# EAGLE design InkTime (EAGLE 9.7.0)
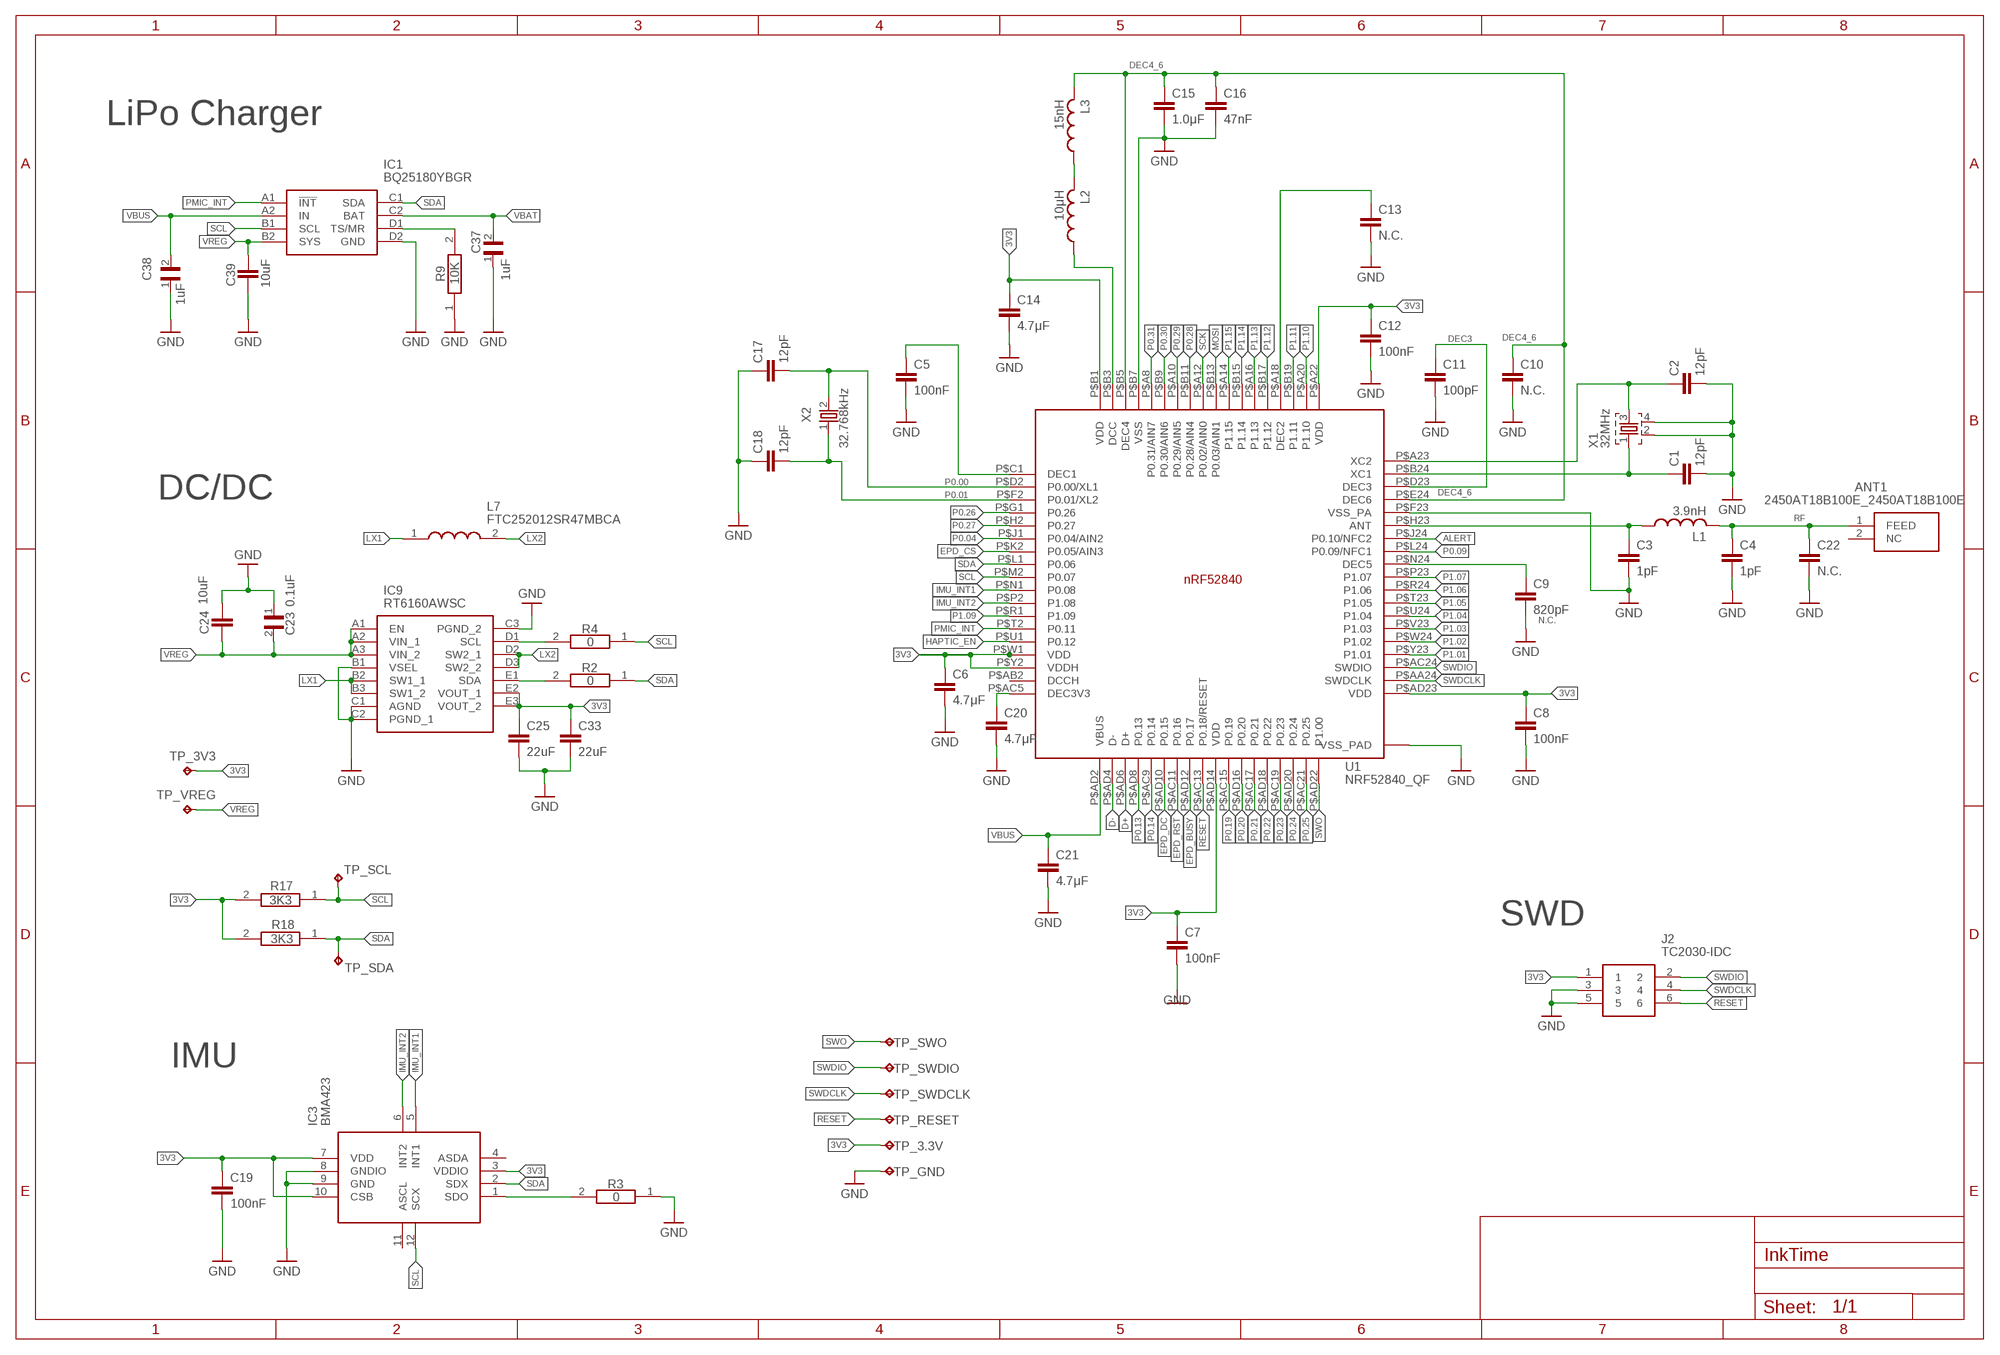
[diagram p0: schematic, sheet 1, part 1 of 2]
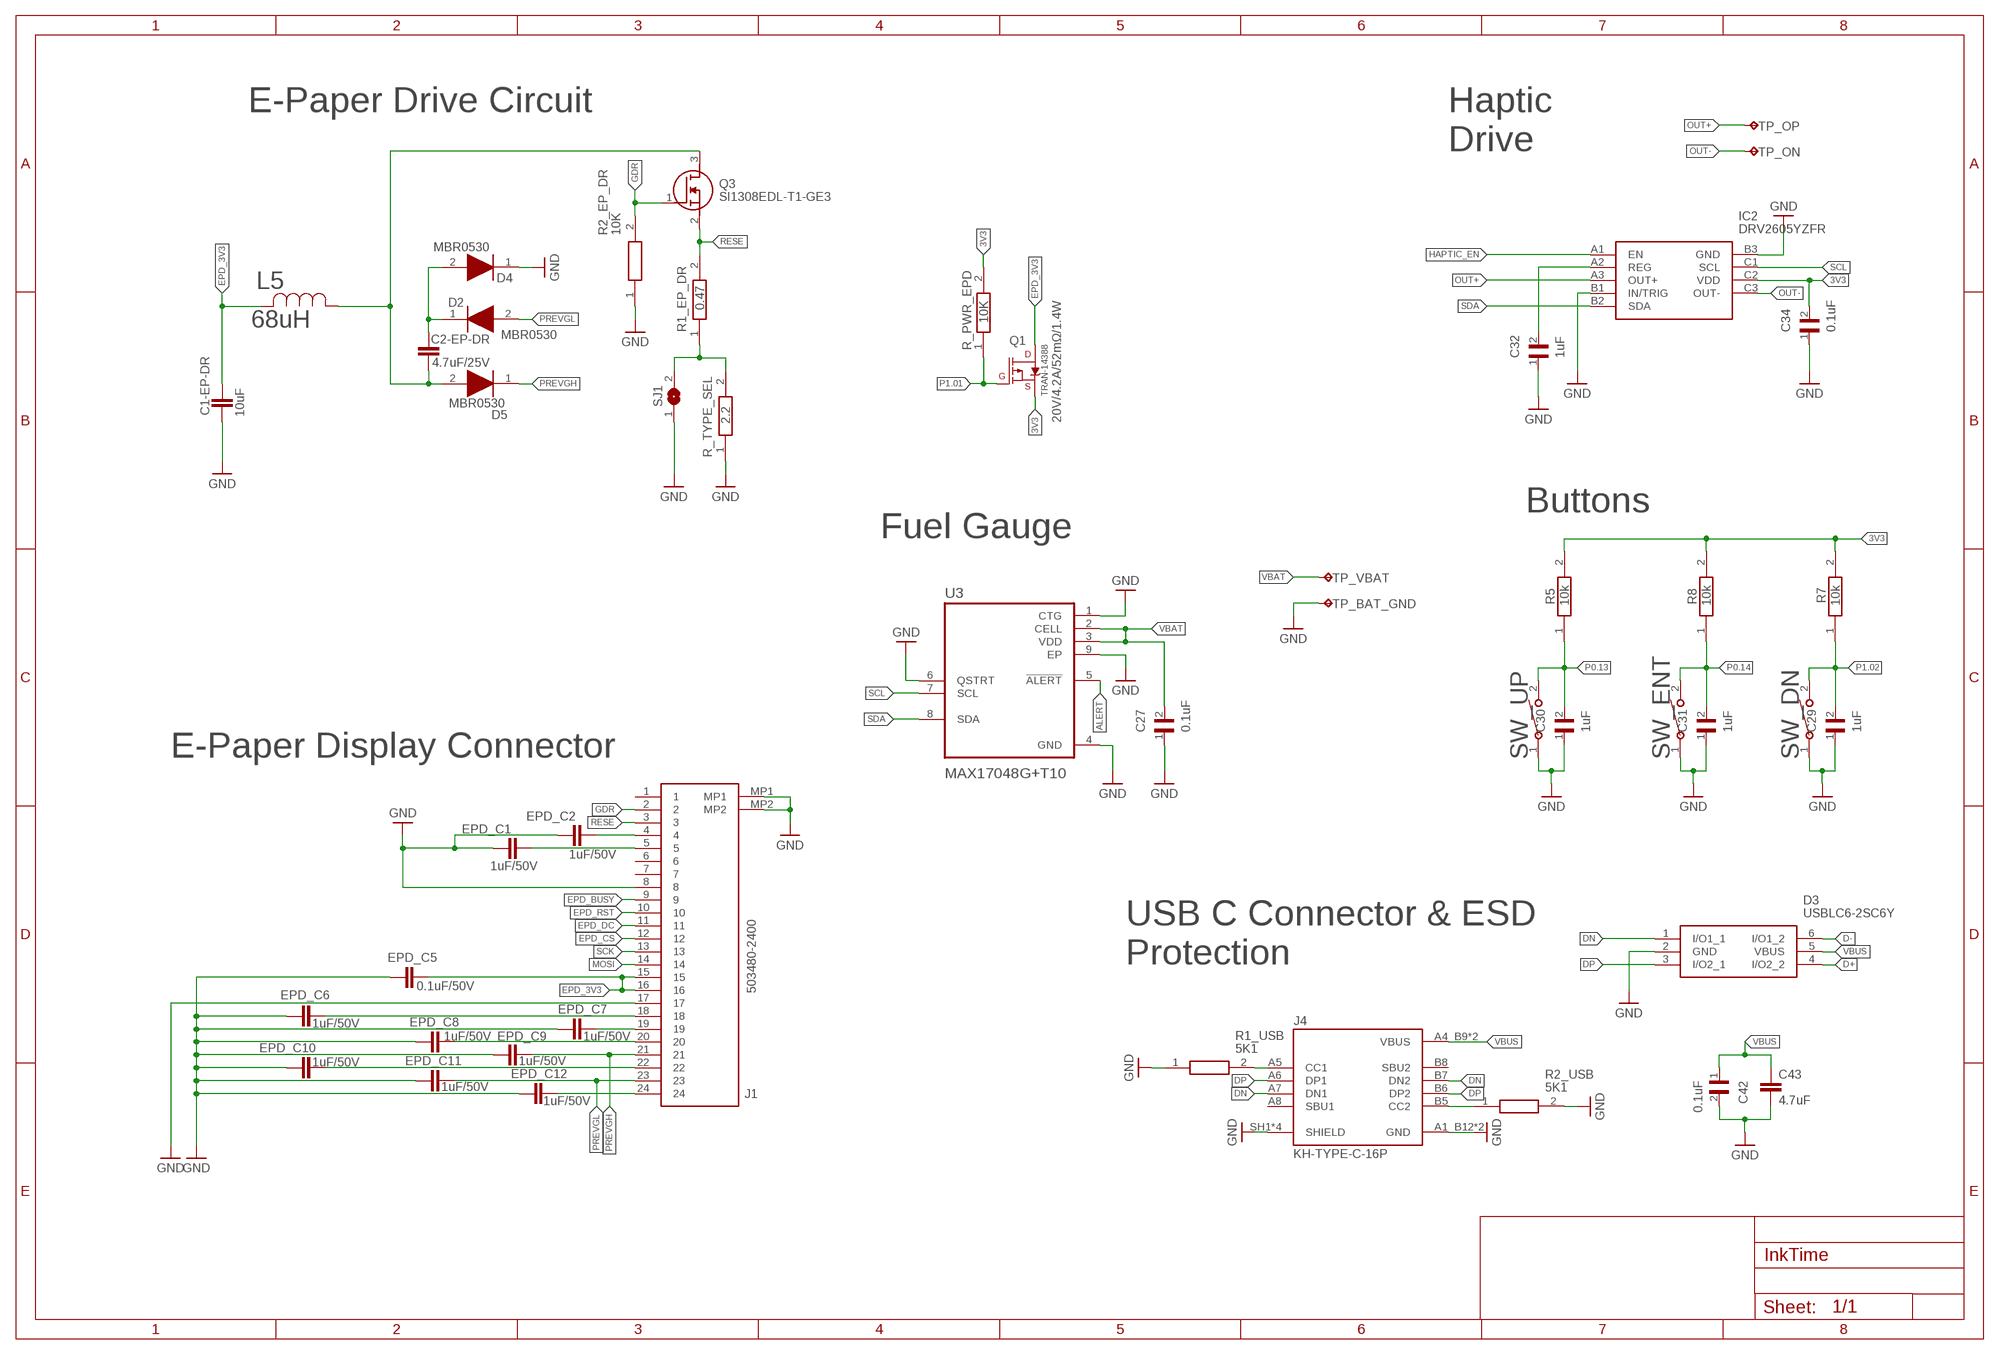
[diagram p1: schematic, sheet 1, part 2 of 2]

## Parts
ANT1  2450AT18B100E_2450AT18B100E  [2450AT18B100E_ANTC3216X140N]
C1  12pF  NORDIC_NRF_3_CAPACITOR_0201_L  [NORDIC_NRF_3_RESC0201_L]
C1-EP-DR  10uF  NORDIC_NRF_3_CAPACITOR_0402_L  [NORDIC_NRF_3_RESC0402_L]
C2  12pF  NORDIC_NRF_3_CAPACITOR_0201_L  [NORDIC_NRF_3_RESC0201_L]
C2-EP-DR  4.7uF/25V  NORDIC_NRF_3_CAPACITOR_0402_L  [NORDIC_NRF_3_RESC0402_L]
C3  1pF  NORDIC_NRF_3_CAPACITOR_0201_L  [NORDIC_NRF_3_RESC0201_L]
C4  1pF  NORDIC_NRF_3_CAPACITOR_0201_L  [NORDIC_NRF_3_RESC0201_L]
C5  100nF  NORDIC_NRF_3_CAPACITOR_0201_L  [NORDIC_NRF_3_RESC0201_L]
C6  4.7μF  NORDIC_NRF_3_CAPACITOR_0402_L  [NORDIC_NRF_3_RESC0402_L]
C7  100nF  NORDIC_NRF_3_CAPACITOR_0201_L  [NORDIC_NRF_3_RESC0201_L]
C8  100nF  NORDIC_NRF_3_CAPACITOR_0201_L  [NORDIC_NRF_3_RESC0201_L]
C9  820pF  NORDIC_NRF_3_CAPACITOR_0201_L  [NORDIC_NRF_3_RESC0201_L]
C10  N.C.  NORDIC_NRF_3_CAPACITOR_0201_L  [NORDIC_NRF_3_RESC0201_L]
C11  100pF  NORDIC_NRF_3_CAPACITOR_0201_L  [NORDIC_NRF_3_RESC0201_L]
C12  100nF  NORDIC_NRF_3_CAPACITOR_0201_L  [NORDIC_NRF_3_RESC0201_L]
C13  N.C.  NORDIC_NRF_3_CAPACITOR_0201_L  [NORDIC_NRF_3_RESC0201_L]
C14  4.7μF  NORDIC_NRF_3_CAPACITOR_0402_L  [NORDIC_NRF_3_RESC0402_L]
C15  1.0μF  NORDIC_NRF_3_CAPACITOR_0402_L  [NORDIC_NRF_3_RESC0402_L]
C16  47nF  NORDIC_NRF_3_CAPACITOR_0201_L  [NORDIC_NRF_3_RESC0201_L]
C17  12pF  NORDIC_NRF_3_CAPACITOR_0201_L  [NORDIC_NRF_3_RESC0201_L]
C18  12pF  NORDIC_NRF_3_CAPACITOR_0201_L  [NORDIC_NRF_3_RESC0201_L]
C19  100nF  NORDIC_NRF_3_CAPACITOR_0201_L  [NORDIC_NRF_3_RESC0201_L]
C20  4.7μF  NORDIC_NRF_3_CAPACITOR_0402_L  [NORDIC_NRF_3_RESC0402_L]
C21  4.7μF  NORDIC_NRF_3_CAPACITOR_0402_L  [NORDIC_NRF_3_RESC0402_L]
C22  N.C.  NORDIC_NRF_3_CAPACITOR_0201_L  [NORDIC_NRF_3_RESC0201_L]
C23  0.1uF  GRM011R60J152KE01L_2_GRM011R60J152KE01L  [GRM011R60J152KE01L_2_CAPC0201X13N]
C24  10uF  NORDIC_NRF_3_CAPACITOR_0402_L  [NORDIC_NRF_3_RESC0402_L]
C25  22uF  NORDIC_NRF_3_CAPACITOR_0402_L  [NORDIC_NRF_3_RESC0402_L]
C27  0.1uF  GRM011R60J152KE01L_2_GRM011R60J152KE01L  [GRM011R60J152KE01L_2_CAPC0201X13N]
C29  1uF  GRM011R60J152KE01L_2_GRM011R60J152KE01L  [GRM011R60J152KE01L_2_CAPC0201X13N]
C30  1uF  GRM011R60J152KE01L_2_GRM011R60J152KE01L  [GRM011R60J152KE01L_2_CAPC0201X13N]
C31  1uF  GRM011R60J152KE01L_2_GRM011R60J152KE01L  [GRM011R60J152KE01L_2_CAPC0201X13N]
C32  1uF  GRM011R60J152KE01L_2_GRM011R60J152KE01L  [GRM011R60J152KE01L_2_CAPC0201X13N]
C33  22uF  NORDIC_NRF_3_CAPACITOR_0402_L  [NORDIC_NRF_3_RESC0402_L]
C34  0.1uF  GRM011R60J152KE01L_2_GRM011R60J152KE01L  [GRM011R60J152KE01L_2_CAPC0201X13N]
C37  1uF  GRM011R60J152KE01L_2_GRM011R60J152KE01L  [GRM011R60J152KE01L_2_CAPC0201X13N]
C38  1uF  GRM011R60J152KE01L_2_GRM011R60J152KE01L  [GRM011R60J152KE01L_2_CAPC0201X13N]
C39  10uF  NORDIC_NRF_3_CAPACITOR_0402_L  [NORDIC_NRF_3_RESC0402_L]
C42  0.1uF  GRM011R60J152KE01L_2_GRM011R60J152KE01L  [GRM011R60J152KE01L_2_CAPC0201X13N]
C43  4.7uF  NORDIC_NRF_3_CAPACITOR_0402_L  [NORDIC_NRF_3_RESC0402_L]
D2  MBR0530  ESP32_C6_LIBRARY_5_MBR0530  [ESP32_C6_LIBRARY_5_SOD3716X135N]
D3  USBLC6-2SC6Y  ESP32_C6_LIBRARY_3_USBLC6-2SC6Y  [ESP32_C6_LIBRARY_3_SOT95P280X145-6N]
D4  MBR0530  ESP32_C6_LIBRARY_5_MBR0530  [ESP32_C6_LIBRARY_5_SOD3716X135N]
D5  MBR0530  ESP32_C6_LIBRARY_5_MBR0530  [ESP32_C6_LIBRARY_5_SOD3716X135N]
EPD_C1  1uF/50V  NORDIC_NRF_3_CAPACITOR_0402_L  [NORDIC_NRF_3_RESC0402_L]
EPD_C2  1uF/50V  NORDIC_NRF_3_CAPACITOR_0402_L  [NORDIC_NRF_3_RESC0402_L]
EPD_C5  0.1uF/50V  NORDIC_NRF_3_CAPACITOR_0201_L  [NORDIC_NRF_3_RESC0201_L]
EPD_C6  1uF/50V  NORDIC_NRF_3_CAPACITOR_0402_L  [NORDIC_NRF_3_RESC0402_L]
EPD_C7  1uF/50V  NORDIC_NRF_3_CAPACITOR_0402_L  [NORDIC_NRF_3_RESC0402_L]
EPD_C8  1uF/50V  NORDIC_NRF_3_CAPACITOR_0402_L  [NORDIC_NRF_3_RESC0402_L]
EPD_C9  1uF/50V  NORDIC_NRF_3_CAPACITOR_0402_L  [NORDIC_NRF_3_RESC0402_L]
EPD_C10  1uF/50V  NORDIC_NRF_3_CAPACITOR_0402_L  [NORDIC_NRF_3_RESC0402_L]
EPD_C11  1uF/50V  NORDIC_NRF_3_CAPACITOR_0402_L  [NORDIC_NRF_3_RESC0402_L]
EPD_C12  1uF/50V  NORDIC_NRF_3_CAPACITOR_0402_L  [NORDIC_NRF_3_RESC0402_L]
IC1  BQ25180YBGR  BQ25180YBGR_BQ25180YBGR  [BQ25180YBGR_BGA8C40P2X4_100X155X50]
IC2  DRV2605YZFR  DRV2605YZFR_DRV2605YZFR  [DRV2605YZFR_BGA9C50P3X3_144X144X62]
IC3  BMA423  BMA423_BMA423  [BMA423_BMA423]
IC9  RT6160AWSC  RT6160AWSC_RT6160AWSC  [RT6160AWSC_BGA15C40P3X5_140X230X60]
J1  503480-2400  503480-2400_503480-2400  [503480-2400_5034802400]
J2  TC2030-IDC  TC2030-IDC_TC2030-IDC  [TC2030-IDC_TC2030IDC]
J4  KH-TYPE-C-16P  KH-TYPE-C-16P_KH-TYPE-C-16P  [KH-TYPE-C-16P_KINGHELM_KH-TYPE-C-16P]
L1  3.9nH  NORDIC_NRF_2_INDUCTOR_0402_L  [NORDIC_NRF_2_RESC0402_L]
L2  10μH  NORDIC_NRF_2_INDUCTOR_0402_L  [NORDIC_NRF_2_RESC0402_L]
L3  15nH  NORDIC_NRF_2_INDUCTOR_0402_L  [NORDIC_NRF_2_RESC0402_L]
L5  68uH  ESP32_C6_LIBRARY_2_744043680IND_4828-WE-TPC_WRE  [ESP32_C6_LIBRARY_2_IND_4828-WE-TPC_WRE]
L7  FTC252012SR47MBCA  MLP2016SR47MT0S1_FTC252012SR47MBCA  [MLP2016SR47MT0S1_INDC2016X100N]
Q1  20V/4.2A/52mΩ/1.4W  ESP32_C6_LIBRARY_4_ESP32_WROVER_SPARKFUN-DISCRETESEMI_MOSFET_PCH-DMG2305UX-7  [ESP32_C6_LIBRARY_4_ESP32_C6_LIBRARY_4_ESP32_C6_LIBRARY_4_ESP32_C6_LIBRARY_4_ESP32_WROVER_SPARKFUN-DISCRETESEMI_SOT23-3]
Q3  SI1308EDL-T1-GE3  ESP32_C6_LIBRARY_6_SI1308EDL-T1-GE3  [ESP32_C6_LIBRARY_6_SOT65P210X110-3N]
R1_EP_DR  0.47  ERA-1AEB3401C_CPF0201D7K68C1  [ERA-1AEB3401C_0201]
R1_USB  5K1  ERA-1AEB3401C_CPF0201D7K68C1  [ERA-1AEB3401C_0201]
R2  0  ERA-1AEB3401C_CPF0201D7K68C1  [ERA-1AEB3401C_0201]
R2_EP_DR  10K  ERA-1AEB3401C_CPF0201D7K68C1  [ERA-1AEB3401C_0201]
R2_USB  5K1  ERA-1AEB3401C_CPF0201D7K68C1  [ERA-1AEB3401C_0201]
R3  0  ERA-1AEB3401C_CPF0201D7K68C1  [ERA-1AEB3401C_0201]
R4  0  ERA-1AEB3401C_CPF0201D7K68C1  [ERA-1AEB3401C_0201]
R5  10k  ERA-1AEB3401C_CPF0201D7K68C1  [ERA-1AEB3401C_0201]
R7  10k  ERA-1AEB3401C_CPF0201D7K68C1  [ERA-1AEB3401C_0201]
R8  10k  ERA-1AEB3401C_CPF0201D7K68C1  [ERA-1AEB3401C_0201]
R9  10K  ERA-1AEB3401C_CPF0201D7K68C1  [ERA-1AEB3401C_0201]
R17  3K3  ERA-1AEB3401C_CPF0201D7K68C1  [ERA-1AEB3401C_0201]
R18  3K3  ERA-1AEB3401C_CPF0201D7K68C1  [ERA-1AEB3401C_0201]
R_PWR_EPD  10K  ERA-1AEB3401C_CPF0201D7K68C1  [ERA-1AEB3401C_0201]
R_TYPE_SEL  2.2  ERA-1AEB3401C_CPF0201D7K68C1  [ERA-1AEB3401C_0201]
SJ1  ESP32_C6_LIBRARY_7_JUMPER_SJ  [ESP32_C6_LIBRARY_7_JUMPER_SJ]
SW_DN  2025-10-22_07-23-44_LIBRARY_EVP-AKE31ASW_EVP-AKE31A_PAN  [2025-10-22_07-23-44_LIBRARY_SW_EVP-AKE31A_PAN]
SW_ENT  2025-10-22_07-23-44_LIBRARY_EVP-AKE31ASW_EVP-AKE31A_PAN  [2025-10-22_07-23-44_LIBRARY_SW_EVP-AKE31A_PAN]
SW_UP  2025-10-22_07-23-44_LIBRARY_EVP-AKE31ASW_EVP-AKE31A_PAN  [2025-10-22_07-23-44_LIBRARY_SW_EVP-AKE31A_PAN]
TP_3.3V  HECTOR_WATCH_1_TPTP20R  [HECTOR_WATCH_1_TP20R]
TP_3V3  HECTOR_WATCH_1_TPTP20R  [HECTOR_WATCH_1_TP20R]
TP_BAT_GND  HECTOR_WATCH_1_TPTP20R  [HECTOR_WATCH_1_TP20R]
TP_GND  HECTOR_WATCH_1_TPTP20R  [HECTOR_WATCH_1_TP20R]
TP_ON  HECTOR_WATCH_1_TPTP20R  [HECTOR_WATCH_1_TP20R]
TP_OP  HECTOR_WATCH_1_TPTP20R  [HECTOR_WATCH_1_TP20R]
TP_RESET  HECTOR_WATCH_1_TPTP20R  [HECTOR_WATCH_1_TP20R]
TP_SCL  HECTOR_WATCH_1_TPTP20R  [HECTOR_WATCH_1_TP20R]
TP_SDA  HECTOR_WATCH_1_TPTP20R  [HECTOR_WATCH_1_TP20R]
TP_SWDCLK  HECTOR_WATCH_1_TPTP20R  [HECTOR_WATCH_1_TP20R]
TP_SWDIO  HECTOR_WATCH_1_TPTP20R  [HECTOR_WATCH_1_TP20R]
TP_SWO  HECTOR_WATCH_1_TPTP20R  [HECTOR_WATCH_1_TP20R]
TP_VBAT  HECTOR_WATCH_1_TPTP20R  [HECTOR_WATCH_1_TP20R]
TP_VREG  HECTOR_WATCH_1_TPTP20R  [HECTOR_WATCH_1_TP20R]
U1  NRF52840_QF  NORDIC_NRF_4_NRF52840_QF  [NORDIC_NRF_4_AQFN50P700X700X85_HS-74N]
U3  MAX17048G+T10  ESP32_C6_LIBRARY_MAX17048G+T10  [ESP32_C6_LIBRARY_SON50P200X200X80-9N]
X1  32MHz  NORDIC_NRF_XTAL_32MHZ  [NORDIC_NRF_BT-XTAL_2016_N]
X2  32.768kHz  NORDIC_NRF_1_XTAL_32KHZ  [NORDIC_NRF_1_XTAL_3215_N]

## Nets
3V3 [Power]: C6.1 C7.1 C8.1 C12.1 C14.1 C19.2 C25.1 C33.1 C34.2 IC2.C2(VDD) IC3.3(VDDIO) IC3.7(VDD) IC3.10(CSB) IC9.E2(VOUT_1) IC9.E3(VOUT_2) J2.1 Q1.2(S) R5.2 R7.2 R8.2 R17.2 R18.2 R_PWR_EPD.2 TP_3.3V.TP TP_3V3.TP U1.P$A22(VDD) U1.P$AD14(VDD) U1.P$AD23(VDD) U1.P$B1(VDD) U1.P$W1(VDD) U1.P$Y2(VDDH)
ALERT: U1.P$J24(P0.10/NFC2) U3.5(!ALERT)
D+ [USB_DP_DM]: D3.4(I/O2_2) U1.P$AD6(D+)
D- [USB_DP_DM]: D3.6(I/O1_2) U1.P$AD4(D-)
DEC3: C11.1 U1.P$D23(DEC3)
DEC4_6: C10.1 C15.1 C16.1 L3.2 U1.P$B5(DEC4) U1.P$E24(DEC6)
DN: D3.1(I/O1_1) J4.A7(DN1) J4.B7(DN2)
DP: D3.3(I/O2_1) J4.A6(DP1) J4.B6(DP2)
EPD_3V3 [Power]: C1-EP-DR.1 EPD_C5.2 J1.15 J1.16 L5.2 Q1.3(D)
EPD_BUSY: J1.9 U1.P$AD12(P0.17)
EPD_CS: J1.12 U1.P$K2(P0.05/AIN3)
EPD_DC: J1.11 U1.P$AD10(P0.15)
EPD_RST: J1.10 U1.P$AC11(P0.16)
GDR [Power]: J1.2 Q3.1(G) R2_EP_DR.2
GND [Power]: C1-EP-DR.2 C1.2 C2.2 C3.2 C4.2 C5.2 C6.2 C7.2 C8.2 C9.2 C10.2 C11.2 C12.2 C13.2 C14.2 C15.2 C16.2 C17.1 C18.1 C19.1 C20.2 C21.2 C22.2 C23.1 C24.1 C25.2 C27.1 C29.1 C30.1 C31.1 C32.1 C33.2 C34.1 C37.1 C38.1 C39.2 C42.2 C43.2 D3.2(GND) D4.1(K) EPD_C1.1 EPD_C2.1 EPD_C5.1 EPD_C6.1 EPD_C7.1 EPD_C8.1 EPD_C9.1 EPD_C10.1 EPD_C11.1 EPD_C12.1 IC1.D2(GND) IC2.B1(IN/TRIG) IC2.B3(GND) IC3.8(GNDIO) IC3.9(GND) IC9.B1(VSEL) IC9.C1(AGND) IC9.C2(PGND_1) IC9.C3(PGND_2) J1.8 J1.17 J1.MP1 J1.MP2 J2.3 J2.5 J4.A1_B12(GND) J4.A12_B1(GND) J4.SH1(SHIELD) J4.SH2(SHIELD) J4.SH3(SHIELD) J4.SH4(SHIELD) R1_USB.1 R2_EP_DR.1 R2_USB.2 R3.1 R9.1 R_TYPE_SEL.1 SJ1.1 SW_DN.1 SW_ENT.1 SW_UP.1 TP_BAT_GND.TP TP_GND.TP U1.P$74(VSS_PAD) U1.P$75(VSS_PAD) U1.P$76(VSS_PAD) U1.P$77(VSS_PAD) U1.P$78(VSS_PAD) U1.P$79(VSS_PAD) U1.P$80(VSS_PAD) U1.P$81(VSS_PAD) U1.P$82(VSS_PAD) U1.P$83(VSS_PAD) U1.P$84(VSS_PAD) U1.P$85(VSS_PAD) U1.P$86(VSS_PAD) U1.P$87(VSS_PAD) U1.P$88(VSS_PAD) U1.P$89(VSS_PAD) U1.P$90(VSS_PAD) U1.P$B7(VSS) U1.P$F23(VSS_PA) U3.1(CTG) U3.4(GND) U3.6(QSTRT) U3.9(EP) X1.2 X1.4
HAPTIC_EN: IC2.A1(EN) U1.P$U1(P0.12)
IMU_INT1: IC3.5(INT1) U1.P$N1(P0.08)
IMU_INT2: IC3.6(INT2) U1.P$P2(P1.08)
LX1 [Power]: IC9.B2(SW1_1) IC9.B3(SW1_2) L7.1
LX2 [Power]: IC9.D2(SW2_1) IC9.D3(SW2_2) L7.2
MOSI: J1.14 U1.P$B13(P0.03/AIN1)
N$1: C5.1 U1.P$C1(DEC1)
N$3 [Power]: C3.1 L1.1 U1.P$H23(ANT)
N$4: C20.1 U1.P$AC5(DEC3V3)
N$5: IC1.D1(TS/MR) R9.2
N$6: C2-EP-DR.2 D5.2(A) L5.1 Q3.3(D)
N$7: C2-EP-DR.1 D2.1(K) D4.2(A)
N$8: IC9.D1(SCL) R4.2
N$9: IC9.E1(SDA) R2.2
N$10: IC3.1(SDO) R3.2
N$11: J4.A5(CC1) R1_USB.2
N$13: EPD_C2.2 J1.4
N$14: EPD_C1.2 J1.5
N$15: R1_EP_DR.1 R_TYPE_SEL.2 SJ1.2
N$17: J4.B5(CC2) R2_USB.1
N$19: C32.2 IC2.A2(REG)
N$23: EPD_C6.2 J1.18
N$24: EPD_C7.2 J1.19
N$25: EPD_C8.2 J1.20
N$27: EPD_C10.2 J1.22
N$29: EPD_C12.2 J1.24
N$45: C9.1 U1.P$N24(DEC5)
N$49: C1.1 U1.P$B24(XC1) X1.1
N$50: C2.1 U1.P$A23(XC2) X1.3
N$54: C13.1 U1.P$A18(DEC2)
N$69: L2.2 L3.1
N$70: L2.1 U1.P$B3(DCC)
OUT+: IC2.A3(OUT+) TP_OP.TP
OUT-: IC2.C3(OUT-) TP_ON.TP
P0.00: C17.2 U1.P$D2(P0.00/XL1) X2.2
P0.01: C18.2 U1.P$F2(P0.01/XL2) X2.1
P0.04: U1.P$J1(P0.04/AIN2)
P0.09: U1.P$L24(P0.09/NFC1)
P0.13: C30.2 R5.1 SW_UP.2 U1.P$AD8(P0.13)
P0.14: C31.2 R8.1 SW_ENT.2 U1.P$AC9(P0.14)
P0.19: U1.P$AC15(P0.19)
P0.20: U1.P$AD16(P0.20)
P0.21: U1.P$AC17(P0.21)
P0.22: U1.P$AD18(P0.22)
P0.23: U1.P$AC19(P0.23)
P0.24: U1.P$AD20(P0.24)
P0.25: U1.P$AC21(P0.25)
P0.26: U1.P$G1(P0.26)
P0.27: U1.P$H2(P0.27)
P0.28: U1.P$B11(P0.28/AIN4)
P0.29: U1.P$A10(P0.29/AIN5)
P0.30: U1.P$B9(P0.30/AIN6)
P0.31: U1.P$A8(P0.31/AIN7)
P1.01: Q1.1(G) R_PWR_EPD.1 U1.P$Y23(P1.01)
P1.02: C29.2 R7.1 SW_DN.2 U1.P$W24(P1.02)
P1.03: U1.P$V23(P1.03)
P1.04: U1.P$U24(P1.04)
P1.05: U1.P$T23(P1.05)
P1.06: U1.P$R24(P1.06)
P1.07: U1.P$P23(P1.07)
P1.09: U1.P$R1(P1.09)
P1.10: U1.P$A20(P1.10)
P1.11: U1.P$B19(P1.11)
P1.12: U1.P$B17(P1.12)
P1.13: U1.P$A16(P1.13)
P1.14: U1.P$B15(P1.14)
P1.15: U1.P$A14(P1.15)
PMIC_INT: IC1.A1(!INT) U1.P$T2(P0.11)
PREVGH [Power]: D5.1(K) EPD_C9.2 J1.21
PREVGL [Power]: D2.2(A) EPD_C11.2 J1.23
RESE: J1.3 Q3.2(S) R1_EP_DR.2
RESET: J2.6 TP_RESET.TP U1.P$AC13(P0.18/RESET)
RF: ANT1.1(FEED) C4.1 C22.1 L1.2
SCK: J1.13 U1.P$A12(P0.02/AIN0)
SCL: IC1.B1(SCL) IC2.C1(SCL) IC3.12(SCX) R4.1 R17.1 TP_SCL.TP U1.P$M2(P0.07) U3.7(SCL)
SDA: IC1.C1(SDA) IC2.B2(SDA) IC3.2(SDX) R2.1 R18.1 TP_SDA.TP U1.P$L1(P0.06) U3.8(SDA)
SWDCLK: J2.4 TP_SWDCLK.TP U1.P$AA24(SWDCLK)
SWDIO: J2.2 TP_SWDIO.TP U1.P$AC24(SWDIO)
SWO: TP_SWO.TP U1.P$AD22(P1.00)
VBAT [Power]: C27.2 C37.2 IC1.C2(BAT) TP_VBAT.TP U3.2(CELL) U3.3(VDD)
VBUS [Power]: C21.1 C38.2 C42.1 C43.1 D3.5(VBUS) IC1.A2(IN) J4.A4_B9(VBUS) J4.A9_B4(VBUS) U1.P$AD2(VBUS)
VREG [Power]: C23.2 C24.2 C39.1 IC1.B2(SYS) IC9.A1(EN) IC9.A2(VIN_1) IC9.A3(VIN_2) TP_VREG.TP
Unconnected: ANT1.2(NC) IC3.4(ASDA) IC3.11(ASCL) J1.1 J1.6 J1.7 J4.A8(SBU1) J4.B8(SBU2) U1.P$AB2(DCCH)

## Notes on the sheet
- LiPo Charger
- DC/DC
- SWD
- IMU
- E-Paper Drive Circuit
- Haptic
  Drive
- Buttons
- Fuel Gauge
- E-Paper Display Connector
- USB C Connector & ESD
  Protection

## Library data of the parts
ANT1 = InkTime_v5:2450AT18B100E_2450AT18B100E: Antennas 2.45GHz ANTENNA Source: Datasheet <https://www.johansontechnology.com/datasheets/2450AT18B100/2450AT18B100.pdf>; ARROW_PART_NUMBER: 2450AT18B100E; ARROW_PRICE-STOCK: https://www.arrow.com/en/products/2450at18b100e/johanson-dielectrics?utm_currency=USD&region=nac; DESCRIPTION: Antennas 2.45GHz ANTENNA; HEIGHT: 1.4mm; MANUFACTURER_NAME: JOHANSON TECHNOLOGY; MANUFACTURER_PART_NUMBER: 2450AT18B100E; MOUSER_PART_NUMBER: 609-2450AT18B100E; MOUSER_PRICE-STOCK: https://www.mouser.co.uk/ProductDetail/Johanson-Technology/2450AT18B100E?qs=yCnrNFeXz%252Bh5MFsFIXGZGA%3D%3D
C1 C1-EP-DR C2 C2-EP-DR C3-C8 C10-C22 C24 C25 C33 C39 C43 EPD_C1 EPD_C2 EPD_C5-EPD_C12 = InkTime_v5:NORDIC_NRF_3_CAPACITOR: Generic chip capacitor
C9 = InkTime_v5:NORDIC_NRF_3_CAPACITOR: Generic chip capacitor; POPULATION: N.C.
C23 C27 C29-C32 C34 C37 C38 C42 = InkTime_v5:GRM011R60J152KE01L_2_GRM011R60J152KE01L: Check availability <https://pricing.snapeda.com/parts/GRM011R60J152KE01L/Murata/view-part?ref=eda>; AVAILABILITY: In Stock; CHECK_PRICES: https://www.snapeda.com/parts/GRM011R60J152KE01L/Murata/view-part/?ref=eda; DESCRIPTION: SMD Capacitor X5R(EIA) with Capacitance: 1500pF Tol. 10%. Rated Voltage: 6.3Vdc; MF: Murata; MP: GRM011R60J152KE01L; PACKAGE: 0201 Murata; PRICE: None; SNAPEDA_LINK: https://www.snapeda.com/parts/GRM011R60J152KE01L/Murata/view-part/?ref=snap
D2 D4 D5 = InkTime_v5:ESP32_C6_LIBRARY_5_MBR0530: ON SEMICONDUCTOR - MBR0530 - DIODE, SCHOTTKY, 0.5A, 30V, SOD-123 Source: Datasheet <http://www.onsemi.com/pub/Collateral/MBR0530T1-D.PDF> Check availability <https://pricing.snapeda.com/parts/MBR0530/ON%20Semiconductor/view-part?ref=eda>; AVAILABILITY: In Stock; CHECK_PRICES: https://www.snapeda.com/parts/MBR0530/Onsemi/view-part/?ref=eda; DESCRIPTION: Diode Schottky 30 V 500mA Surface Mount SOD-123; MF: ON Semiconductor; MP: MBR0530; PACKAGE: SOD-123-2 ON Semiconductor; PRICE: None; PURCHASE-URL: https://www.snapeda.com/api/url_track_click_mouser/?unipart_id=179458&manufacturer=ON Semiconductor&part_name=MBR0530&search_term=None; SNAPEDA_LINK: https://www.snapeda.com/parts/MBR0530/Onsemi/view-part/?ref=snap
D3 = InkTime_v5:ESP32_C6_LIBRARY_3_USBLC6-2SC6Y: Low Cap. ESD Protection Auto SOT-23-6 STMicroelectronics USBLC6-2SC6Y, Dual Uni-Directional TVS Diode Array, 6-Pin SOT-23 Source: Datasheet <https://componentsearchengine.com/Datasheets/1/USBLC6-2SC6Y.pdf> Check availability <https://pricing.snapeda.com/parts/USBLC6-2SC6Y/STMicroelectronics/view-part?ref=eda>; AVAILABILITY: In Stock; CHECK_PRICES: https://www.snapeda.com/parts/USBLC6-2SC6Y/STMicroelectronics/view-part/?ref=eda; DESCRIPTION: 17V Clamp 5A (8/20µs) Ipp Tvs Diode Surface Mount SOT-23-6; MF: STMicroelectronics; MP: USBLC6-2SC6Y; PACKAGE: SOT-23-6 STMicroelectronics; PRICE: None; SNAPEDA_LINK: https://www.snapeda.com/parts/USBLC6-2SC6Y/STMicroelectronics/view-part/?ref=snap
IC1 = InkTime_v5:BQ25180YBGR_BQ25180YBGR: Charger IC Lithium Ion/Polymer, Lithium Iron Phosphate 8-DSBGA (1.6x1.1) Source: Datasheet <https://www.ti.com/lit/ds/symlink/bq25180.pdf?ts=1650264094470&ref_url=https%3A%2F%2Fwww.ti.com%2Fproduct%2FBQ25180>; ARROW_PART_NUMBER: BQ25180YBGR; ARROW_PRICE-STOCK: https://www.arrow.com/en/products/bq25180ybgr/texas-instruments?utm_currency=USD&region=nac; DESCRIPTION: Charger IC Lithium Ion/Polymer, Lithium Iron Phosphate 8-DSBGA (1.6x1.1); HEIGHT: 0.5mm; MANUFACTURER_NAME: Texas Instruments; MANUFACTURER_PART_NUMBER: BQ25180YBGR; MOUSER_PART_NUMBER: 595-BQ25180YBGR; MOUSER_PRICE-STOCK: https://www.mouser.co.uk/ProductDetail/Texas-Instruments/BQ25180YBGR?qs=doiCPypUmgEWjAK%252BJAX6Tw%3D%3D
IC2 = InkTime_v5:DRV2605YZFR_DRV2605YZFR: Haptic Driver for ERM/LRA with Built-In Library and Smart Loop Architecture Source: Datasheet <http://www.ti.com/lit/gpn/drv2605>; ARROW_PART_NUMBER: DRV2605YZFR; ARROW_PRICE-STOCK: https://www.arrow.com/en/products/drv2605yzfr/texas-instruments?region=nac; DESCRIPTION: Haptic Driver for ERM/LRA with Built-In Library and Smart Loop Architecture; HEIGHT: 0.625mm; MANUFACTURER_NAME: Texas Instruments; MANUFACTURER_PART_NUMBER: DRV2605YZFR
IC3 = InkTime_v5:BMA423_BMA423: Accelerometers Triaxial low-g 12bit Acceleration Sensor Source: Datasheet <https://www.mouser.com/datasheet/2/783/BST-BMA423-DS000-1509600.pdf>; ARROW_PART_NUMBER: BMA423; ARROW_PRICE-STOCK: https://www.arrow.com/en/products/bma423/bosch; DESCRIPTION: Accelerometers Triaxial low-g 12bit Acceleration Sensor; HEIGHT: 1mm; MANUFACTURER_NAME: BOSCH; MANUFACTURER_PART_NUMBER: BMA423; MOUSER_PART_NUMBER: 262-BMA423; MOUSER_PRICE-STOCK: https://www.mouser.co.uk/ProductDetail/Bosch-Sensortec/BMA423?qs=HXFqYaX1Q2xC%252BSgeGoX3mg%3D%3D
IC9 = InkTime_v5:RT6160AWSC_RT6160AWSC: Buck-Boost Regulator Positive Output Step-Up/Step-Down I2C DC-DC Controller IC 15-WL-CSP (BSC) (1.4x2.3) Source: Datasheet <https://www.richtek.com/SaveDownload.aspx?specid=RT6160A>; DESCRIPTION: Buck-Boost Regulator Positive Output Step-Up/Step-Down I2C DC-DC Controller IC 15-WL-CSP (BSC) (1.4x2.3); HEIGHT: 0.6mm; MANUFACTURER_NAME: RICHTEK; MANUFACTURER_PART_NUMBER: RT6160AWSC; MOUSER_PART_NUMBER: 835-RT6160AWSC; MOUSER_PRICE-STOCK: https://www.mouser.co.uk/ProductDetail/Richtek/RT6160AWSC?qs=amGC7iS6iy%2FLd9PSoixZXQ%3D%3D
J1 = InkTime_v5:503480-2400_503480-2400: FFC & FPC Connectors 0.5mm FPC RA SMT Dual Contact 24Ckt Source: Datasheet <https://componentsearchengine.com/Datasheets/1/503480-2400.pdf>; DESCRIPTION: FFC & FPC Connectors 0.5mm FPC RA SMT Dual Contact 24Ckt; HEIGHT: 1.87mm; MANUFACTURER_NAME: Molex; MANUFACTURER_PART_NUMBER: 503480-2400; MOUSER_PART_NUMBER: 538-503480-2400; MOUSER_PRICE-STOCK: https://www.mouser.co.uk/ProductDetail/Molex/503480-2400?qs=OAhjpuo3Vu7efIoxFh9AOw%3D%3D
J2 = InkTime_v5:TC2030-IDC_TC2030-IDC: CABLE ADAPTER 6 POS Source: Datasheet <https://datasheet.datasheetarchive.com/originals/distributors/Datasheets_SAMA/62bc384e093448baaaa63dbd0b9d8707.pdf>; DESCRIPTION: CABLE ADAPTER 6 POS; HEIGHT: 19mm; MANUFACTURER_NAME: Tag Connect; MANUFACTURER_PART_NUMBER: TC2030-IDC
J4 = InkTime_v5:KH-TYPE-C-16P_KH-TYPE-C-16P: Check availability <https://pricing.snapeda.com/parts/KH-TYPE-C-16P/kinghelm/view-part?ref=eda>; AVAILABILITY: Not in stock; CHECK_PRICES: https://www.snapeda.com/parts/KH-TYPE-C-16P/Kinghelm/view-part/?ref=eda; MF: kinghelm; MP: KH-TYPE-C-16P; PACKAGE: None; PRICE: None; SNAPEDA_LINK: https://www.snapeda.com/parts/KH-TYPE-C-16P/Kinghelm/view-part/?ref=snap
L1-L3 = InkTime_v5:NORDIC_NRF_2_INDUCTOR: Generic chip inductor
L5 = InkTime_v5:ESP32_C6_LIBRARY_2_744043680; COPYRIGHT: Copyright (C) 2024 Ultra Librarian. All rights reserved.; MANUFACTURER_PART_NUMBER: 744043680; MFR_NAME: Wurth Electronics
L7 = InkTime_v5:MLP2016SR47MT0S1_FTC252012SR47MBCA: SMD / SMT Inductors (Coils), L=0.47?H, L x W x T : Source: Datasheet <https://product.tdk.com/system/files/dam/doc/product/inductor/inductor/smd/catalog/inductor_commercial_power_mlp2016_en.pdf>; DESCRIPTION: SMD / SMT Inductors (Coils), L=0.47?H, L x W x T :; HEIGHT: 1mm; JLCPCB: https://jlcpcb.com/partdetail/6763488-FTC252012SR47MBCA/C5832368; MANUFACTURER_NAME: TDK; MANUFACTURER_PART_NUMBER: FTC252012SR47MBCA
Q1 = InkTime_v5:ESP32_C6_LIBRARY_4_ESP32_WROVER_SPARKFUN-DISCRETESEMI_MOSFET_PCH: P-channel MOSFETs Voltage controlled devices that allow control of high current outputs. SparkFun Products: SparkFun ESP32 Thing <https://www.sparkfun.com/products/13907> SparkFun ESP8266 Thing <https://www.sparkfun.com/products/13231> SparkFun Pi Servo HAT V2 <https://www.sparkfun.com/products/15316> DMG2305UX-7 (20V/4.2A/SOT23-3); PROD_ID: TRAN-14388
Q3 = InkTime_v5:ESP32_C6_LIBRARY_6_SI1308EDL-T1-GE3: MOSFET N-Ch 30V 1.5A TrenchFET SC70 Vishay Si1308EDL-T1-GE3 N-channel MOSFET Transistor, 1.5 A, 30 V, 3-Pin SC-70 Source: Datasheet <https://componentsearchengine.com/Datasheets/1/SI1308EDL-T1-GE3.pdf> Check availability <https://pricing.snapeda.com/parts/SI1308EDL-T1-GE3/Vishay%20Siliconix/view-part?ref=eda>; AVAILABILITY: In Stock; CHECK_PRICES: https://www.snapeda.com/parts/SI1308EDL-T1-GE3/Vishay+Siliconix/view-part/?ref=eda; DESCRIPTION: Si1308EDL-T1-GE3 N-channel MOSFET Transistor, 1.5 A, 30 V, 3-Pin SC-70 | Siliconix / Vishay SI1308EDL-T1-GE3; MF: Vishay Siliconix; MP: SI1308EDL-T1-GE3; PACKAGE: SOT-323 Vishay Semiconductor; PRICE: None; PURCHASE-URL: https://www.snapeda.com/api/url_track_click_mouser/?unipart_id=274603&manufacturer=Vishay Siliconix&part_name=SI1308EDL-T1-GE3&search_term=None; SNAPEDA_LINK: https://www.snapeda.com/parts/SI1308EDL-T1-GE3/Vishay+Siliconix/view-part/?ref=snap
R1_EP_DR R1_USB R2 R2_EP_DR R2_USB R3-R5 R7-R9 R17 R18 R_PWR_EPD R_TYPE_SEL = InkTime_v5:ERA-1AEB3401C_CPF0201D7K68C1: 7.68k 0201 Thin Film Surface Mount Fixed Resistor +/-0.5% 0.031W CPF0201D7K68C1 Source: Datasheet <http://www.te.com/commerce/DocumentDelivery/DDEController?Action=showdoc&DocId=Data Sheet1773200-1ApdfEnglishENG_DS_1773200-1_A.pdf4-2176215-6>
SJ1 = InkTime_v5:ESP32_C6_LIBRARY_7_JUMPER_SJ: SMD solder JUMPER
SW_DN SW_ENT SW_UP = InkTime_v5:2025-10-22_07-23-44_LIBRARY_EVP-AKE31A; COPYRIGHT: Copyright (C) 2025 Ultra Librarian. All rights reserved.; DIGI-KEY_PART_NUMBER_1: P123437TR-ND; DIGI-KEY_PART_NUMBER_2: P123437CT-ND; DIGI-KEY_PART_NUMBER_3: P123437DKR-ND; MANUFACTURER_NAME: Panasonic; MANUFACTURER_PART_NUMBER: EVP-AKE31A
TP_3.3V TP_3V3 TP_BAT_GND TP_GND TP_ON TP_OP TP_RESET TP_SCL TP_SDA TP_SWDCLK TP_SWDIO TP_SWO TP_VBAT TP_VREG = InkTime_v5:HECTOR_WATCH_1_TP: Test pad
U1 = InkTime_v5:NORDIC_NRF_4_NRF52840_QF: nRF52840 Features Advanced Single chip 2.4 GHz multi-protocol SoC 32-bit ARM Cortex-M4F Processor 1.7v to 5.5v operation 1MB flash + 256kB RAM Bluetooth 5 support for long range and high throughput 802.15.4 radio support On-chip NFC PPI –Programmable Peripheral Interconnect Automated power management system with automatic power management of each peripheral Configurable I/O mapping for analog and digital I/O 48 x GPIO 1 x QSPI 4 x Master/Slave SPI 2 x Two-wire interface (I²C) I²S interface 2 x UART 4 x PWM USB 2.0 controller ARM TrustZone CryptoCell-310 Cryptographic and security module AES 128-bit ECB/CCM/AAR hardware accelerator Digital microphone interface (PDM) Quadrature decoder 12-bit ADC Low power comparator On-chip 50Ω balun On-air compatible with nRF52, nRF51 and nRF24 Series Applications Advanced high performance wearables Wearables for secure payments Virtual Reality/Augmented Reality systems Smart Home sensor networks Smart city sensor networks High performance HID controllers Internet of Things (IoT) sensor networks Smart door locks Smart lighting networks Connected white goods
U3 = InkTime_v5:ESP32_C6_LIBRARY_MAX17048G+T10: Check availability <https://pricing.snapeda.com/parts/MAX17048G%2BT10/Analog%20Devices/view-part?ref=eda>; AVAILABILITY: In Stock; CHECK_PRICES: https://www.snapeda.com/parts/MAX17048G+T10/Analog+Devices/view-part/?ref=eda; DESCRIPTION: 3µA 1-Cell/2-Cell Fuel Gauge with ModelGauge; MF: Analog Devices; MP: MAX17048G+T10; PACKAGE: TDFN-8 Maxim; PRICE: None; PURCHASE-URL: https://www.snapeda.com/api/url_track_click_mouser/?unipart_id=329239&manufacturer=Analog Devices&part_name=MAX17048G+T10&search_term=None; SNAPEDA_LINK: https://www.snapeda.com/parts/MAX17048G+T10/Analog+Devices/view-part/?ref=snap
X1 = InkTime_v5:NORDIC_NRF_XTAL_32MHZ
X2 = InkTime_v5:NORDIC_NRF_1_XTAL_32KHZ

## Net classes
0 default: width 0.15 mm
1 Power: width 0.3 mm

## Board
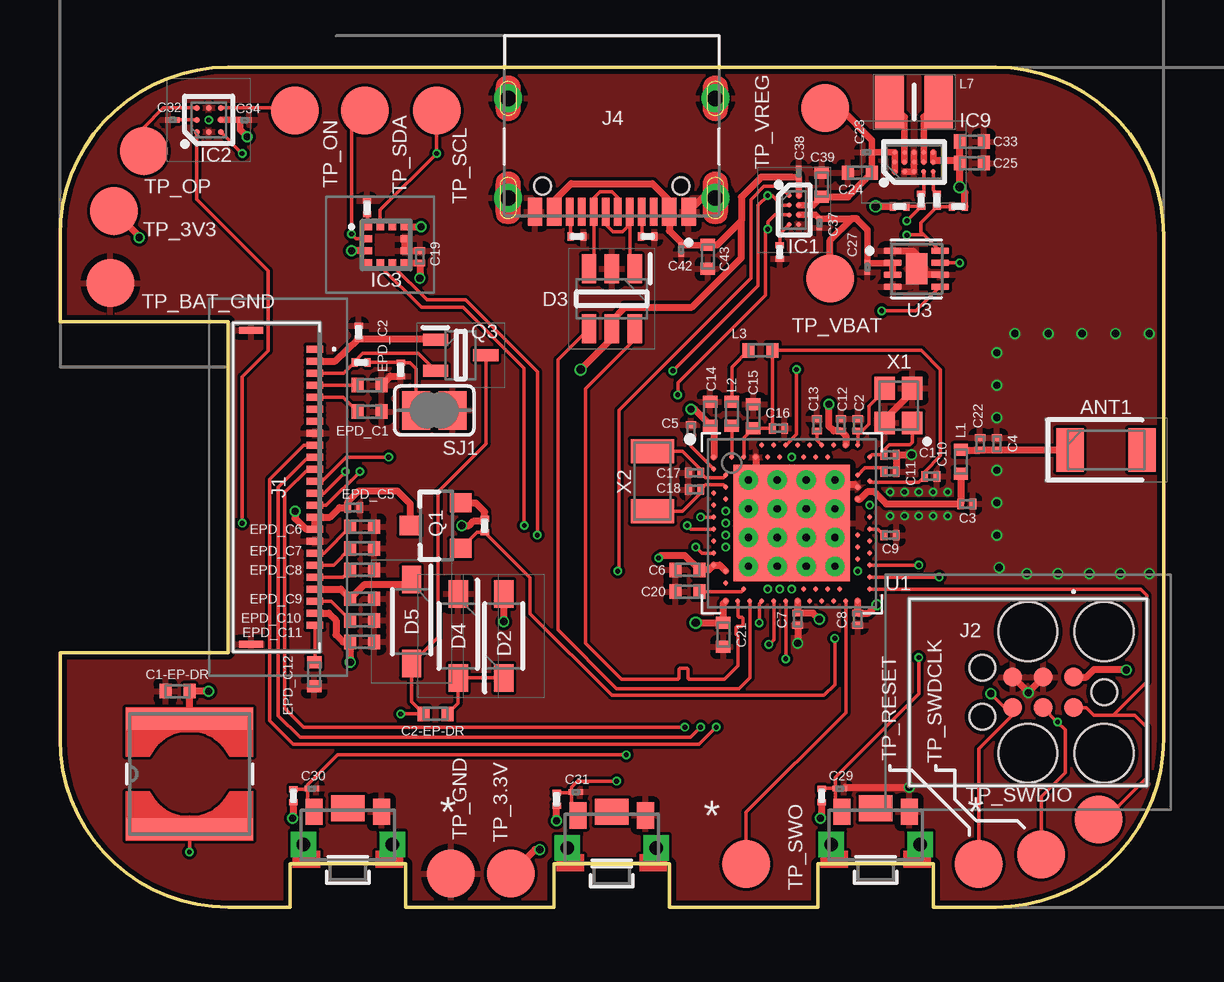
[diagram p2: board, top side]
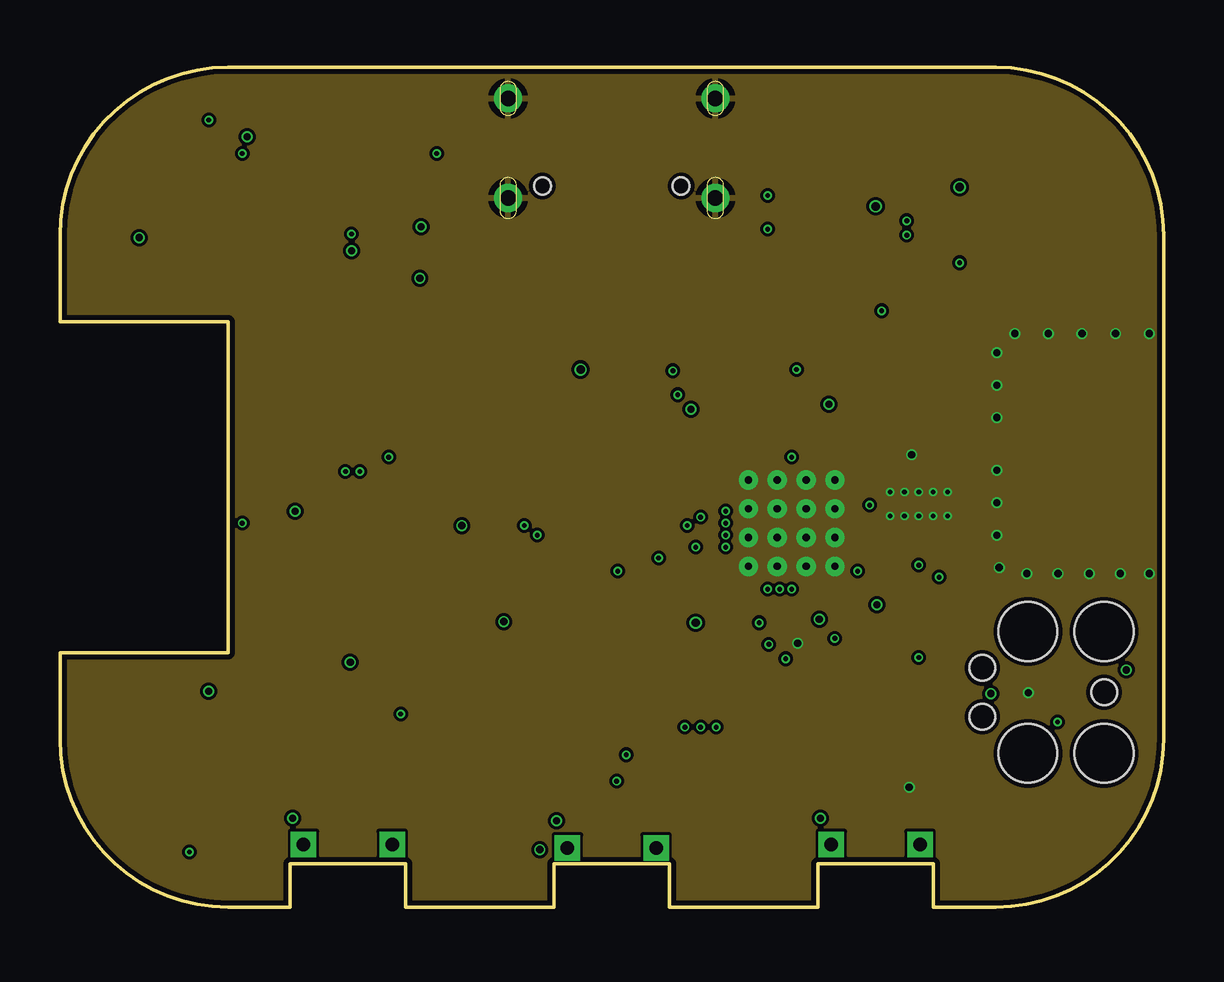
[diagram p3: board, inner layer Route2]
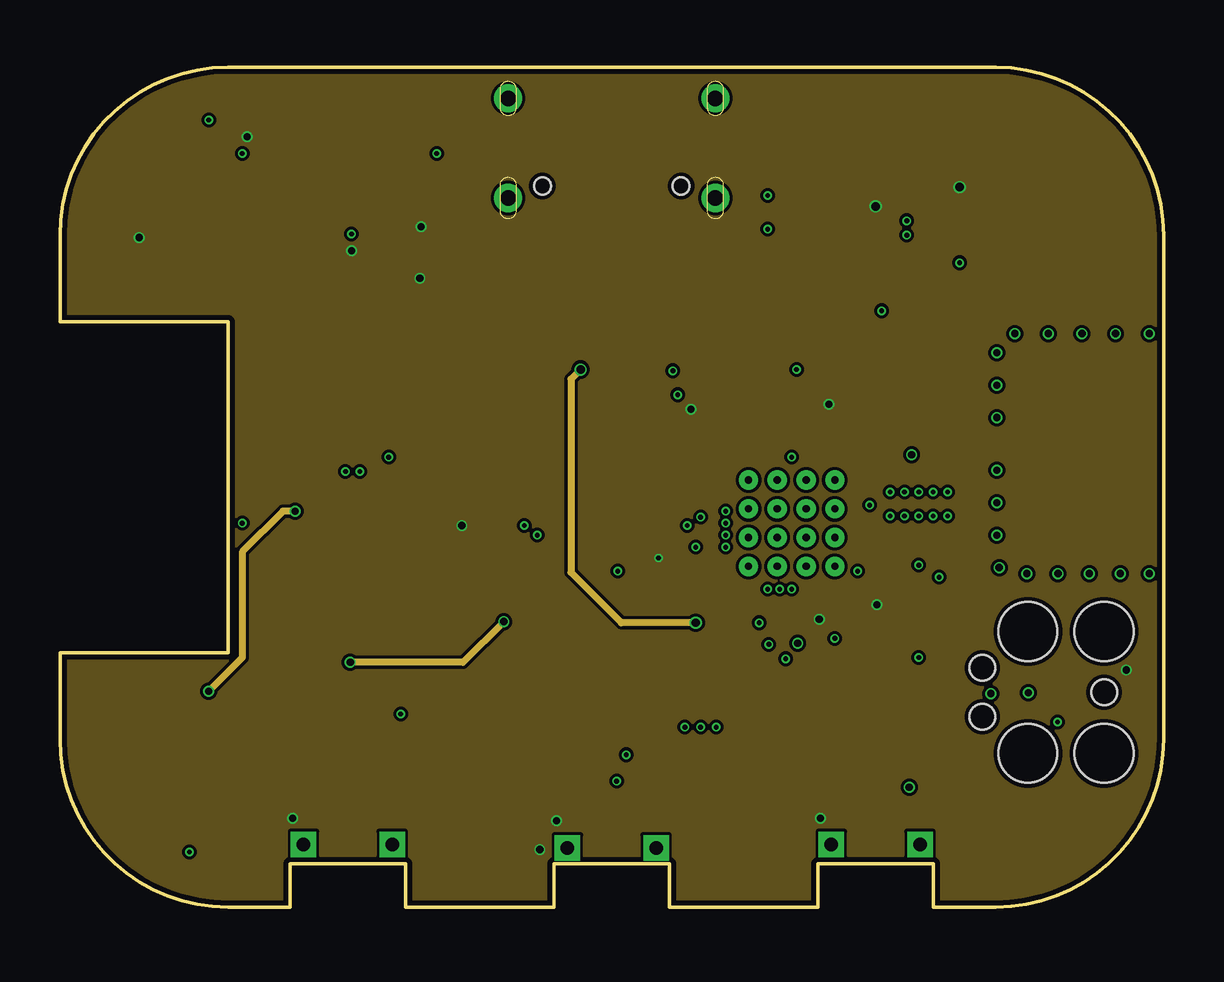
[diagram p4: board, inner layer Route15]
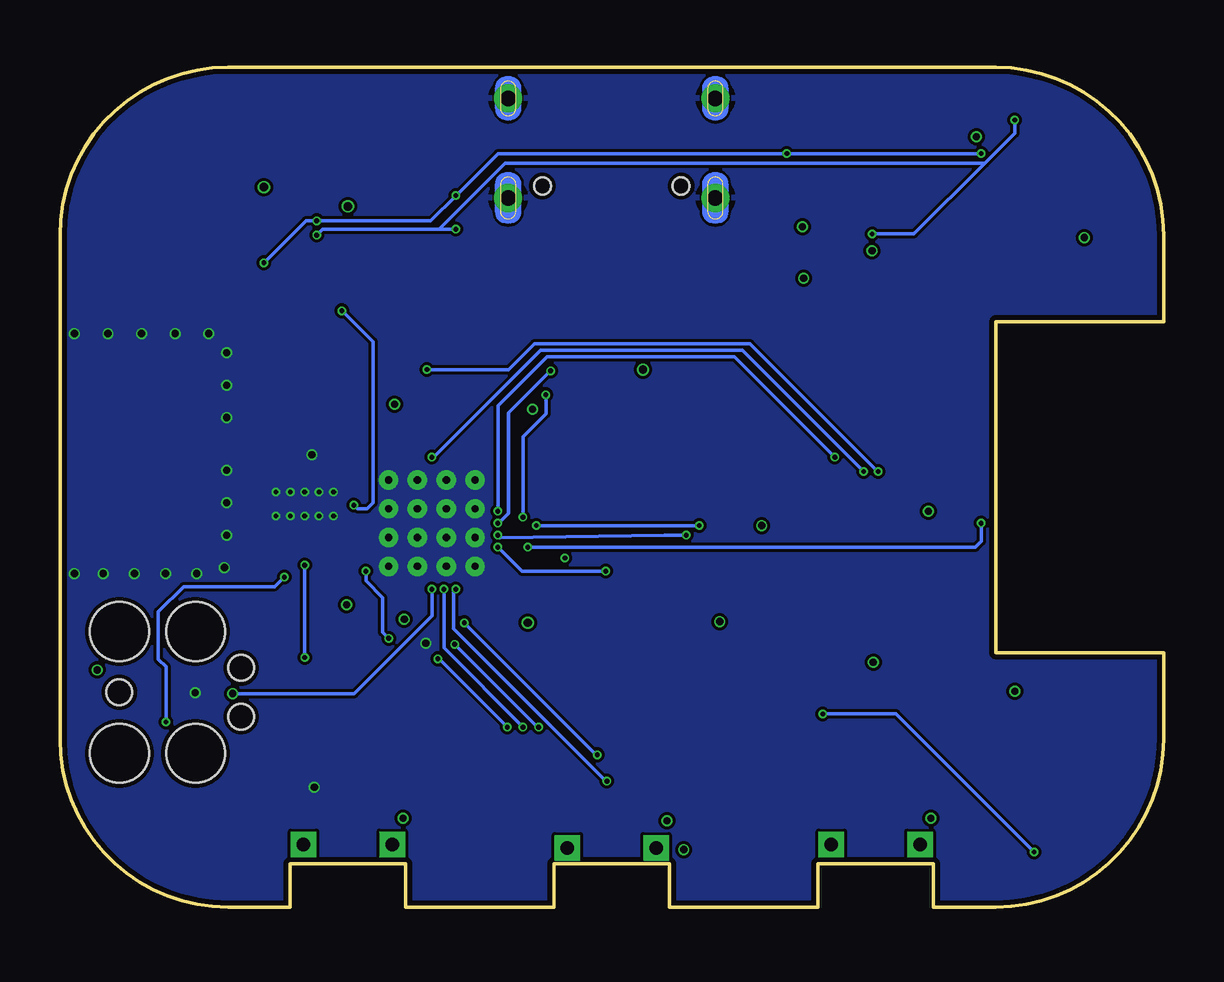
[diagram p5: board, bottom side, seen from below]

Size 46 x 35 mm. Coordinates in mm from the lower left corner, seen from the top.
Outline: 39,0 36.4,0 36.4,1.8 31.6,1.8 31.6,0 25.4,0 25.4,1.8 20.6,1.8 20.6,0 14.4,0 14.4,1.8 9.6,1.8 9.6,0 7,0 arc-90 0,7 0,10.6 7,10.6 7,24.4 0,24.4 0,28 arc-90 7,35 39,35 arc-90 46,28 46,7 arc-90 39,0
Copper layers (1+2*15+16): Top 0.035mm / dielectric 1.6mm / Route2 0.035mm / dielectric 0.15mm / Route15 0.035mm / dielectric 0.2mm / Bottom 0.035mm
Design rules "jlcpcb-2layers.dru *": minimum track width 5mil, minimum drill 0.2mm, track to track 5mil, track to pad 5mil, pad to pad 5mil, via to via 5mil, smd to smd 5mil, copper to edge 0.2mm, drill to drill 6mil, minimum pad ring 10mil, minimum via ring 3mil, stop-mask expansion 4mil, vias tented up to drill 999mm, thermal gap 10mil

### Footprints (pad centres in the part's own frame; a part is rotated, then mirrored left to right if it is on the bottom)
2450AT18B100E_ANTC3216X140N = smd 1.15 x 1.8: 1 -1.5,0; 2 1.5,0
NORDIC_NRF_3_RESC0201_L = smd 0.28 x 0.43: 1 -0.255,0; 2 0.255,0
NORDIC_NRF_3_RESC0402_L = smd 0.5 x 0.6: 1 -0.5,0; 2 0.5,0
GRM011R60J152KE01L_2_CAPC0201X13N = smd 0.22 x 0.23: 1 -0.185,0; 2 0.185,0
ESP32_C6_LIBRARY_5_SOD3716X135N = smd 1.15 x 0.8: 1 -1.75,0; 2 1.75,0
ESP32_C6_LIBRARY_3_SOT95P280X145-6N = smd 1.2 x 0.6: 1 -1.25,0.95; 2 -1.25,0; 3 -1.25,-0.95; 4 1.25,-0.95; 5 1.25,0; 6 1.25,0.95
BQ25180YBGR_BGA8C40P2X4_100X155X50 = smd 0.2 x 0.2: A1 -0.2,0.6; A2 0.2,0.6; B1 -0.2,0.2; B2 0.2,0.2; C1 -0.2,-0.2; C2 0.2,-0.2; D1 -0.2,-0.6; D2 0.2,-0.6
DRV2605YZFR_BGA9C50P3X3_144X144X62 = smd 0.25 x 0.25: A1 -0.5,0.5; A2 0,0.5; A3 0.5,0.5; B1 -0.5,0; B2 0,0; B3 0.5,0; C1 -0.5,-0.5; C2 0,-0.5; C3 0.5,-0.5
BMA423_BMA423 = smd 0.3 x 0.35: 1 -0.75,-0.775; 2 -0.25,-0.775; 3 0.25,-0.775; 4 0.75,-0.775; 7 0.75,0.775; 8 0.25,0.775; 9 -0.25,0.775; 10 -0.75,0.775 | smd 0.35 x 0.3: 5 0.775,-0.25; 6 0.775,0.25; 11 -0.775,0.25; 12 -0.775,-0.25
RT6160AWSC_BGA15C40P3X5_140X230X60 = smd 0.216 x 0.216: A1 -0.4,0.8; A2 0,0.8; A3 0.4,0.8; B1 -0.4,0.4; B2 0,0.4; B3 0.4,0.4; C1 -0.4,0; C2 0,0; C3 0.4,0; D1 -0.4,-0.4; D2 0,-0.4; D3 0.4,-0.4; E1 -0.4,-0.8; E2 0,-0.8; E3 0.4,-0.8
503480-2400_5034802400 = smd 0.3 x 0.7: 1 -5.75,1.525; 2 -5.25,1.525; 3 -4.75,1.525; 4 -4.25,1.525; 5 -3.75,1.525; 6 -3.25,1.525; 7 -2.75,1.525; 8 -2.25,1.525; 9 -1.75,1.525; 10 -1.25,1.525; 11 -0.75,1.525; 12 -0.25,1.525; 13 0.25,1.525; 14 0.75,1.525; 15 1.25,1.525; 16 1.75,1.525; 17 2.25,1.525; 18 2.75,1.525; 19 3.25,1.525; 20 3.75,1.525; 21 4.25,1.525; 22 4.75,1.525; 23 5.25,1.525; 24 5.75,1.525 | smd 0.3 x 1: MP1 -6.54,-1.125; MP2 6.54,-1.125
TC2030-IDC_TC2030IDC = smd 0.783 x 0.783: 1 -0.953,-0.635; 2 -0.953,0.635; 3 0.317,-0.635; 4 0.317,0.635; 5 1.588,-0.635; 6 1.588,0.635 | hole 2.451: -2.223,-2.54; -2.223,2.54; 0.952,-2.54; 0.952,2.54 | hole 1.067: -2.223,0; 2.857,-1.016; 2.857,1.016
KH-TYPE-C-16P_KINGHELM_KH-TYPE-C-16P = smd 0.6 x 1.15: A1_B12 -3.2,4.725; A4_B9 -2.4,4.725; A9_B4 2.4,4.725; A12_B1 3.2,4.725 | smd 0.3 x 1.15: A5 -1.25,4.725; A6 -0.25,4.725; A7 0.25,4.725; A8 1.25,4.725; B5 1.75,4.725; B6 0.75,4.725; B7 -0.75,4.725; B8 -1.75,4.725 | drill 0.65 pad 1.05: SH1 -4.32,0; SH2 4.32,0; SH3 -4.32,4.15; SH4 4.32,4.15 | hole 0.7: -2.89,3.65; 2.89,3.65
NORDIC_NRF_2_RESC0402_L = smd 0.5 x 0.6: 1 -0.5,0; 2 0.5,0
ESP32_C6_LIBRARY_2_IND_4828-WE-TPC_WRE = smd 0.9 x 5.3: 1 -2.286,0; 2 2.286,0
MLP2016SR47MT0S1_INDC2016X100N = smd 1.2 x 2.2: 1 -1.028,0; 2 1.028,0
ESP32_C6_LIBRARY_4_ESP32_C6_LIBRARY_4_ESP32_C6_LIBRARY_4_ESP32_C6_LIBRARY_4_ESP32_WROVER_SPARKFUN-DISCRETESEMI_SOT23-3 = smd 0.8 x 0.9: 1 -0.95,-1; 2 0.95,-1; 3 0,1.1
ESP32_C6_LIBRARY_6_SOT65P210X110-3N = smd 1.05 x 0.5: 1 -1.05,0.65; 2 -1.05,-0.65; 3 1.05,0
ERA-1AEB3401C_0201 = smd 0.35 x 0.25: 1 0,0.275; 2 0,-0.275
ESP32_C6_LIBRARY_7_JUMPER_SJ = smd 1.168 x 1.6: 1 -0.762,0; 2 0.762,0
2025-10-22_07-23-44_LIBRARY_SW_EVP-AKE31A_PAN = smd 0.711 x 1.092: 1 -1.4,-0.972; 2 1.4,-0.972 | drill 0.559 pad 0.914 square: 3 -1.848,0.381; 4 1.848,0.381 | smd 1.397 x 1.092: 5 0,-1.124
HECTOR_WATCH_1_TP20R = smd 2 x 2: TP 0,0
NORDIC_NRF_4_AQFN50P700X700X85_HS-74N = smd 4.85 x 4.85: P$74 0,0 | drill 0.3 pad 0.6: P$75 -1.8,1.8; P$76 -0.6,1.8; P$77 0.6,1.8; P$78 1.8,1.8; P$79 -1.8,0.6; P$80 -0.6,0.6; P$81 0.6,0.6; P$82 1.8,0.6; P$83 -1.8,-0.6; P$84 -0.6,-0.6; P$85 0.6,-0.6; P$86 1.8,-0.6; P$87 -1.8,-1.8; P$88 -0.6,-1.8; P$89 0.6,-1.8; P$90 1.8,-1.8 | smd 0.2 x 0.2: P$A8 -1.25,3.25; P$A10 -0.75,3.25; P$A12 -0.25,3.25; P$A14 0.25,3.25; P$A16 0.75,3.25; P$A18 1.25,3.25; P$A20 1.75,3.25; P$A22 2.25,3.25; P$A23 2.75,3.25; P$AA24 3.25,-2.25; P$AB2 -2.75,-2.5; P$AC5 -2,-2.75; P$AC9 -1,-2.75; P$AC11 -0.5,-2.75; P$AC13 0,-2.75; P$AC15 0.5,-2.75; P$AC17 1,-2.75; P$AC19 1.5,-2.75; P$AC21 2,-2.75; P$AC24 3.25,-2.75; P$AD2 -2.75,-3.25; P$AD4 -2.25,-3.25; P$AD6 -1.75,-3.25; P$AD8 -1.25,-3.25; P$AD10 -0.75,-3.25; P$AD12 -0.25,-3.25; P$AD14 0.25,-3.25; P$AD16 0.75,-3.25; P$AD18 1.25,-3.25; P$AD20 1.75,-3.25; P$AD22 2.25,-3.25; P$AD23 2.75,-3.25; P$B1 -3.25,2.75; P$B3 -2.5,2.75; P$B5 -2,2.75; P$B7 -1.5,2.75; P$B9 -1,2.75; P$B11 -0.5,2.75; P$B13 0,2.75; P$B15 0.5,2.75; P$B17 1,2.75; P$B19 1.5,2.75; P$B24 3.25,2.75; P$C1 -3.25,2.25; P$D2 -2.75,2; P$D23 2.75,2; P$E24 3.25,1.75; P$F2 -2.75,1.5; P$F23 2.75,1.5; P$G1 -3.25,1.25; P$H2 -2.75,1; P$H23 2.75,1; P$J1 -3.25,0.75; P$J24 3.25,0.75; P$K2 -2.75,0.5; P$L1 -3.25,0.25; P$L24 3.25,0.25; P$M2 -2.75,0; P$N1 -3.25,-0.25; P$N24 3.25,-0.25; P$P2 -2.75,-0.5; P$P23 2.75,-0.5; P$R1 -3.25,-0.75; P$R24 3.25,-0.75; P$T2 -2.75,-1; P$T23 2.75,-1; P$U1 -3.25,-1.25; P$U24 3.25,-1.25; P$V23 2.75,-1.5; P$W1 -3.25,-1.75; P$W24 3.25,-1.75; P$Y2 -2.75,-2; P$Y23 2.75,-2
ESP32_C6_LIBRARY_SON50P200X200X80-9N = smd 0.76 x 0.27: 1 -0.985,0.75; 2 -0.985,0.25; 3 -0.985,-0.25; 4 -0.985,-0.75; 5 0.985,-0.75; 6 0.985,-0.25; 7 0.985,0.25; 8 0.985,0.75 | smd 0.9 x 1.3: 9 0,0
NORDIC_NRF_BT-XTAL_2016_N = smd 0.95 x 0.85: 1 -0.725,-0.575; 2 0.725,-0.575; 3 0.725,0.575; 4 -0.725,0.575
NORDIC_NRF_1_XTAL_3215_N = smd 1 x 1.8: 1 -1.25,0; 2 1.25,0

### Placement (x,y rotation side)
ANT1  43.6,19.05 0 top
C1  34.6,18.85 0 top
C1-EP-DR  4.9,9 180 top
C2  33.25,20.1 90 top
C2-EP-DR  15.65,8.05 180 top
C3  37.8,16.8 0 top
C4  39.05,19.3 90 top
C5  26.3,19.85 90 top
C6  26.15,14.05 180 top
C7  30.75,12 270 top
C8  33.25,12 270 top
C9  34.6,15.5 0 top
C10  36.3,17.95 0 top
C11  34.6,18.15 0 top
C12  32.55,20.1 90 top
C13  31.55,20.1 90 top
C14  27.1,20.55 90 top
C15  28.9,20.45 90 top
C16  29.95,19.95 0 top
C17  26.45,18.1 0 top
C18  26.45,17.4 0 top
C19  15,27.1 270 top
C20  26.15,13.15 180 top
C21  27.65,11.35 270 top
C22  38.35,19.3 90 top
C23  33.65,31.45 0 top
C24  33.35,30.6 0 top
C25  38,31 0 top
C27  33.65,26.65 90 top
C29  32.5,4.95 180 top
C30  10.5,4.95 180 top
C31  21.5,4.8 180 top
C32  4.7,32.8 0 top
C33  38,31.9 0 top
C34  7.7,32.8 180 top
C37  31.65,28.5 90 top
C38  30.8,30.6 270 top
C39  31.75,30.1 90 top
C42  25.9,27.4 270 top
C43  27,27.1 270 top
D2  18.5,11.3 90 top
D3  23,25.35 270 top
D4  16.6,11.3 270 top
D5  14.65,11.9 270 top
EPD_C1  12.9,20.65 180 top
EPD_C2  12.9,21.75 180 top
EPD_C5  12.25,16.65 180 top
EPD_C6  12.6,15.85 180 top
EPD_C7  12.6,14.95 180 top
EPD_C8  12.6,14.05 180 top
EPD_C9  12.6,12.85 180 top
EPD_C10  12.6,11.95 180 top
EPD_C11  12.6,11.05 180 top
EPD_C12  10.6,9.7 90 top
IC1  30.6,29.05 0 top
IC2  6.2,32.8 90 top
IC3  13.6,27.6 270 top
IC9  35.6,31.05 90 top
J1  9.1,17.5 270 top
J2  41.3,8.95 180 top
J4  23,33.7 180 top
L1  37.55,18.55 90 top
L2  28,20.55 90 top
L3  29.2,23.2 0 top
L5  5.4,5.55 90 top
L7  35.6,33.55 0 top
Q1  15.7,15.9 90 top
Q3  16.7,23 0 top
R1_EP_DR  12.55,22.7 270 top
R1_USB  24.5,27.95 270 top
R2  36.55,29.45 180 top
R2_EP_DR  12.45,23.95 0 top
R2_USB  21.55,27.95 90 top
R3  12.8,29.15 0 top
R4  35.9,29.45 180 top
R5  9.73,4.64 0 top
R7  31.75,4.65 0 top
R8  20.7,4.5 0 top
R9  30,27.3 180 top
R17  35,29.2 270 top
R18  37.45,29.2 90 top
R_PWR_EPD  17.7,15.9 180 top
R_TYPE_SEL  14.2,22.4 180 top
SJ1  15.6,20.7 180 top
SW_DN  34,3 180 top
SW_ENT  23,2.85 180 top
SW_UP  12,3 180 top
TP_3.3V  18.8,1.4 0 top
TP_3V3  2.25,29 0 top
TP_BAT_GND  2.1,26 0 top
TP_GND  16.3,1.4 0 top
TP_ON  9.8,33.2 180 top
TP_OP  3.5,31.5 180 top
TP_RESET  38.3,1.8 0 top
TP_SCL  15.7,33.2 0 top
TP_SDA  12.7,33.2 0 top
TP_SWDCLK  40.9,2.2 180 top
TP_SWDIO  43.3,3.65 180 top
TP_SWO  28.6,1.8 0 top
TP_VBAT  32.1,26.2 0 top
TP_VREG  31.9,33.3 0 top
U1  30.5,16 0 top
U3  35.7,26.6 0 top
X1  34.95,20.9 90 top
X2  24.7,17.75 90 top

### Tracks (layer width: path | path; a pad name or v marks a point on that pad's centre or on a via)
3V3  (via drill 0.2, 0.3, 0.35)
  Top 0.268: IC9.E3 IC9.E2 36.45,31.1 | IC2.C2 C34.2 7.52,32.38
  Top 0.3: 36.45,31.1 37.4,31.1 C25.1 | C25.1 C33.1 | R18.2 37.73,29.77 v37.5,30 C25.1 | v34,29.2 R17.2 | U1.P$A22 32.75,19.64 C12.1 32.25,19.84 32.05,20.05 v32.05,20.95 | U1.P$B1 27.25,19.9 C14.1 27.1,20.1 26.45,20.75 v26.3,20.75 | U1.P$AD14 C7.1 31.39,12.25 v31.65,12 | U1.P$AD23 C8.1 33.7,12.25 v34.05,12.6 | U1.P$Y2 27.5,14.25 U1.P$W1 27.05,14.05 C6.1 26.05,14.65 25.05,14.65 v24.95,14.55 | Q1.2 17.32,16.85 17.7,16.48 R_PWR_EPD.2 17.6,16.07 17.23,16.07 17.05,15.9 v16.75,15.9 | v20.7,3.6 R8.2 | v9.7,3.7 9.73,3.73 R5.2 | v31.7,3.7 31.75,3.75 R7.2 | IC3.7 C19.2 v15,26.2 | TP_3.3V.TP 19.8,2.4 v20,2.4 | IC3.10 v15.05,28.35 | IC3.3 v12.15,27.35 | TP_3V3.TP 3.3,27.95 v3.3,27.9 | v7.8,32.1 7.52,32.38 | J2.1 42.78,9.59 43.1,9.9 44.44,9.9 v44.45,9.88
  pour Route15: 7.06,10.56 7.04,10.54 7.02,10.52 0.08,10.52 0.08,7 0.12,6.22 0.25,5.46 0.46,4.71 0.76,4 1.14,3.32 1.59,2.68 2.1,2.1 2.68,1.59 3.32,1.14 4,0.76 4.71,0.46 5.46,0.25 6.22,0.12 7,0.08 9.52,0.08 9.52,1.82 9.54,1.84 9.56,1.86 9.58,1.88 14.42,1.88 14.44,1.86 14.46,1.84 14.48,1.82 14.48,0.08 20.52,0.08 20.52,1.82 20.54,1.84 20.56,1.86 20.58,1.88 25.42,1.88 25.44,1.86 25.46,1.84 25.48,1.82 25.48,0.08 31.52,0.08 31.52,1.82 31.54,1.84 31.56,1.86 31.58,1.88 36.42,1.88 36.44,1.86 36.46,1.84 36.48,1.82 36.48,0.08 39,0.08 39.78,0.12 40.54,0.25 41.29,0.46 42,0.76 42.68,1.14 43.32,1.59 43.9,2.1 44.41,2.68 44.86,3.32 45.24,4 45.54,4.71 45.75,5.46 45.88,6.22 45.92,7 45.92,28 45.88,28.78 45.75,29.54 45.54,30.29 45.24,31 44.86,31.68 44.41,32.32 43.9,32.9 43.32,33.41 42.68,33.86 42,34.24 41.29,34.54 40.54,34.75 39.78,34.88 39,34.92 7,34.92 6.22,34.88 5.46,34.75 4.71,34.54 4,34.24 3.32,33.86 2.68,33.41 2.1,32.9 1.59,32.32 1.14,31.68 0.76,31 0.46,30.29 0.25,29.54 0.12,28.78 0.08,28 0.08,24.48 7.02,24.48 7.04,24.46 7.06,24.44 7.08,24.42 7.08,10.58
ALERT  (via drill 0.2)
  Top 0.15: U3.5 35.69,24.85 v34.25,24.85
  Bottom 0.15: v34.25,24.85 32.95,23.55 32.95,16.85 33.2,16.6 33.6,16.6 U1.P$J24
  other vias: 33.75,16.75
D+
  Top 0.15: D3.4 20.75,22.8 20.75,11.55 23.2,9.1 28.3,9.1 28.75,9.55 U1.P$AD6
D-
  Top 0.15: U1.P$AD4 28.25,12.13 28.29,12.09 28.43,12.09 28.47,12.04 28.47,11.76 28.43,11.71 28.22,11.71 28.18,11.67 28.18,11.38 28.25,11.3 28.25,10.05 27.7,9.5 26.22,9.5 26.18,9.54 26.18,9.9 26.13,9.95 25.85,9.95 25.8,9.9 25.8,9.54 25.76,9.5 23.4,9.5 21.9,11 21.9,21.6 23.95,23.65 D3.6
DEC3
  Top 0.15: U1.P$D23 33.55,18.3 34.34,18.3 C11.1
DEC4_6
  Top 0.15: U1.P$B5 28.5,19.55 C15.1 C16.1 29.7,21.39 29.7,21.4 L3.2 35.9,23.2 36.7,22.4 36.7,18.8 36.05,18.15 C10.1 35.8,17.7 33.8,17.7 U1.P$E24
DN
  Top 0.15: 23.75,28.45 23.75,26.8 D3.1 | 23.75,28.45 J4.B7 | J4.A7 22.8,28.93 22.8,28.4 23.05,28.15 23.45,28.15 23.75,28.45
DP
  Top 0.15: D3.3 22.25,26.8 J4.B6 22.25,29.55 22.5,29.8 23,29.8 23.25,29.55 J4.A6
EPD_3V3  (via drill 0.3)
  Top 0.3: L5.2 C1-EP-DR.1 v6.2,9 | v9.8,16.5 9.8,16.2 10.25,15.75 J1.16 J1.15 11.25,16.25 11.65,16.65 EPD_C5.2 11.99,16.89 12.45,17.34 14.06,17.34 14.6,16.8 Q1.3
  Route15 0.3: v9.8,16.5 9.3,16.5 7.6,14.8 7.6,10.4 v6.2,9
EPD_BUSY  (via drill 0.2)
  Top 0.15: v30.25,10.35 U1.P$AD12 | J1.9 10.17,19.25 8.75,17.83 8.75,7.77 9.72,6.79 26.64,6.79 v27.35,7.5
  Bottom 0.15: v30.25,10.35 30.2,10.35 v27.35,7.5
EPD_CS  (via drill 0.2)
  Top 0.15: v13.7,18.75 11.93,18.75 10.93,17.75 J1.12
  Bottom 0.15: v13.7,18.75 17.88,22.93 25.71,22.93 27.75,20.88 U1.P$K2
  other vias: 27.75,16.5
EPD_DC  (via drill 0.2)
  Top 0.15: U1.P$AD10 29.75,11.15 v29.55,10.95 | J1.11 10.34,18.25 9.37,17.28 9.37,8.29 10.16,7.5 v26.05,7.5
  Bottom 0.15: v29.55,10.95 26.1,7.5 v26.05,7.5
EPD_RST  (via drill 0.2)
  Top 0.15: v26.7,7.5 26.27,7.07 10,7.07 9.1,7.98 9.1,17.5 10.34,18.75 J1.10
  Bottom 0.15: U1.P$AC11 30,10.8 v26.7,7.5
  other vias: 30,13.25
GDR
  Top 0.3: J1.2 11.47,22.75 R2_EP_DR.2 15.62,23.68 Q3.1
GND  (via drill 0.2, 0.3)
  Top 0.268: IC9.B1 IC9.C1 IC9.C2 IC9.C3 | C29.1 32.73,5
  Top 0.28: U1.P$F23 33.15,17.6
  Top 0.3: EPD_C2.1 13.78,22.12 R_TYPE_SEL.1 | IC3.9 IC3.8 C19.1 | X1.4 34.38,20.32 35.52,21.48 X1.2 | C11.2 C1.2 v35.5,18.85 | U3.1 35.55,27.35 35.7,27.2 U3.9 35.95,26.35 U3.6 | 40.36,8.96 J2.3 | 40.36,8.96 v40.36,8.94 | U1.P$B7 29,18.1 U1.P$75 | 33.15,17.6 32.5,17.6 U1.P$78 | C7.2 v30.75,11 | 32.73,5 v35.4,5 | J4.A1_B12 26.77,29.55 J4.SH3 | U1.P$80 U1.P$74 | J2.5 39.74,9.59 40.36,8.96
  other vias: 45.4,23.9 44,23.9 42.6,23.9 41.2,23.9 39.8,23.9 39.05,23.1 39.05,21.75 39.05,20.4 39.05,16.85 39.05,15.5 41.6,13.9 42.9,13.9 44.2,13.9 45.4,13.9 40.3,13.9 34.6,17.3 35.2,17.3 35.8,17.3 36.4,17.3 37,17.3 37,16.3 36.4,16.3 35.8,16.3 35.2,16.3 34.6,16.3 39.05,18.2 39.15,14.15
  pour Top: 7.06,10.56 7.04,10.54 7.02,10.52 0.08,10.52 0.08,7 0.12,6.22 0.25,5.46 0.46,4.71 0.76,4 1.14,3.32 1.59,2.68 2.1,2.1 2.68,1.59 3.32,1.14 4,0.76 4.71,0.46 5.46,0.25 6.22,0.12 7,0.08 9.52,0.08 9.52,1.82 9.54,1.84 9.56,1.86 9.58,1.88 14.42,1.88 14.44,1.86 14.46,1.84 14.48,1.82 14.48,0.08 20.52,0.08 20.52,1.82 20.54,1.84 20.56,1.86 20.58,1.88 25.42,1.88 25.44,1.86 25.46,1.84 25.48,1.82 25.48,0.08 31.52,0.08 31.52,1.82 31.54,1.84 31.56,1.86 31.58,1.88 36.42,1.88 36.44,1.86 36.46,1.84 36.48,1.82 36.48,0.08 39,0.08 39.78,0.12 40.54,0.25 41.29,0.46 42,0.76 42.68,1.14 43.32,1.59 43.9,2.1 44.41,2.68 44.86,3.32 45.24,4 45.54,4.71 45.75,5.46 45.88,6.22 45.92,7 45.92,28 45.88,28.78 45.75,29.54 45.54,30.29 45.24,31 44.86,31.68 44.41,32.32 43.9,32.9 43.32,33.41 42.68,33.86 42,34.24 41.29,34.54 40.54,34.75 39.78,34.88 39,34.92 7,34.92 6.22,34.88 5.46,34.75 4.71,34.54 4,34.24 3.32,33.86 2.68,33.41 2.1,32.9 1.59,32.32 1.14,31.68 0.76,31 0.46,30.29 0.25,29.54 0.12,28.78 0.08,28 0.08,24.48 7.02,24.48 7.04,24.46 7.06,24.44 7.08,24.42 7.08,10.58
  pour Route2: 7.06,10.56 7.04,10.54 7.02,10.52 0.08,10.52 0.08,7 0.12,6.22 0.25,5.46 0.46,4.71 0.76,4 1.14,3.32 1.59,2.68 2.1,2.1 2.68,1.59 3.32,1.14 4,0.76 4.71,0.46 5.46,0.25 6.22,0.12 7,0.08 9.52,0.08 9.52,1.82 9.54,1.84 9.56,1.86 9.58,1.88 14.42,1.88 14.44,1.86 14.46,1.84 14.48,1.82 14.48,0.08 20.52,0.08 20.52,1.82 20.54,1.84 20.56,1.86 20.58,1.88 25.42,1.88 25.44,1.86 25.46,1.84 25.48,1.82 25.48,0.08 31.52,0.08 31.52,1.82 31.54,1.84 31.56,1.86 31.58,1.88 36.42,1.88 36.44,1.86 36.46,1.84 36.48,1.82 36.48,0.08 39,0.08 39.78,0.12 40.54,0.25 41.29,0.46 42,0.76 42.68,1.14 43.32,1.59 43.9,2.1 44.41,2.68 44.86,3.32 45.24,4 45.54,4.71 45.75,5.46 45.88,6.22 45.92,7 45.92,28 45.88,28.78 45.75,29.54 45.54,30.29 45.24,31 44.86,31.68 44.41,32.32 43.9,32.9 43.32,33.41 42.68,33.86 42,34.24 41.29,34.54 40.54,34.75 39.78,34.88 39,34.92 7,34.92 6.22,34.88 5.46,34.75 4.71,34.54 4,34.24 3.32,33.86 2.68,33.41 2.1,32.9 1.59,32.32 1.14,31.68 0.76,31 0.46,30.29 0.25,29.54 0.12,28.78 0.08,28 0.08,24.48 7.02,24.48 7.04,24.46 7.06,24.44 7.08,24.42 7.08,10.58
  pour Bottom: 7.06,10.56 7.04,10.54 7.02,10.52 0.08,10.52 0.08,7 0.12,6.22 0.25,5.46 0.46,4.71 0.76,4 1.14,3.32 1.59,2.68 2.1,2.1 2.68,1.59 3.32,1.14 4,0.76 4.71,0.46 5.46,0.25 6.22,0.12 7,0.08 9.52,0.08 9.52,1.82 9.54,1.84 9.56,1.86 9.58,1.88 14.42,1.88 14.44,1.86 14.46,1.84 14.48,1.82 14.48,0.08 20.52,0.08 20.52,1.82 20.54,1.84 20.56,1.86 20.58,1.88 25.42,1.88 25.44,1.86 25.46,1.84 25.48,1.82 25.48,0.08 31.52,0.08 31.52,1.82 31.54,1.84 31.56,1.86 31.58,1.88 36.42,1.88 36.44,1.86 36.46,1.84 36.48,1.82 36.48,0.08 39,0.08 39.78,0.12 40.54,0.25 41.29,0.46 42,0.76 42.68,1.14 43.32,1.59 43.9,2.1 44.41,2.68 44.86,3.32 45.24,4 45.54,4.71 45.75,5.46 45.88,6.22 45.92,7 45.92,28 45.88,28.78 45.75,29.54 45.54,30.29 45.24,31 44.86,31.68 44.41,32.32 43.9,32.9 43.32,33.41 42.68,33.86 42,34.24 41.29,34.54 40.54,34.75 39.78,34.88 39,34.92 7,34.92 6.22,34.88 5.46,34.75 4.71,34.54 4,34.24 3.32,33.86 2.68,33.41 2.1,32.9 1.59,32.32 1.14,31.68 0.76,31 0.46,30.29 0.25,29.54 0.12,28.78 0.08,28 0.08,24.48 7.02,24.48 7.04,24.46 7.06,24.44 7.08,24.42 7.08,10.58
HAPTIC_EN  (via drill 0.2)
  Top 0.15: IC2.A1 5.7,29.5 8.68,26.52 8.68,23.18 7.6,22.1 v7.6,16 | v26.5,15 26.75,14.75 U1.P$U1
  Bottom 0.15: v26.5,15 7.85,15 7.6,15.25 v7.6,16
IMU_INT1  (via drill 0.2)
  Top 0.15: U1.P$N1 26.3,15.75 v26.15,15.9 | v19.35,15.9 19.35,22.46 16.81,25 15.06,25 13.35,26.71 IC3.5
  Bottom 0.15: v26.15,15.9 v19.35,15.9
IMU_INT2  (via drill 0.2)
  Top 0.15: IC3.6 13.85,26.74 15.29,25.3 16.9,25.3 19.9,22.3 v19.9,15.5
  Bottom 0.15: U1.P$P2 27.65,15.4 20.8,15.5 v19.9,15.5
  other vias: 27.75,15.5
LX1
  Top 0.268: 35.2,32.92 IC9.B3 IC9.B2
  Top 0.3: L7.1 35.2,32.92
LX2
  Top 0.268: 36,32.92 IC9.D3 IC9.D2
  Top 0.3: 36,32.92 L7.2
MOSI  (via drill 0.2)
  Top 0.15: v12.5,18.15 11.1,16.75 J1.14
  Bottom 0.15: U1.P$B13 30.43,18.75 25.98,23.2 17.55,23.2 v12.5,18.15
  other vias: 30.5,18.75
N$1
  Top 0.15: C5.1 26.3,19.2 U1.P$C1
N$3
  Top 0.3: L1.1 C3.1 34.45,16.8 33.95,17.3 33.65,17.3 33.35,17 U1.P$H23
N$4
  Top 0.15: C20.1 28.4,13.15 U1.P$AC5
N$5
  Top 0.15: IC1.D1 30,28.05 R9.2
N$6  (via drill 0.2)
  Top 0.15: Q3.3 17.75,19.3 15.75,17.3 15.75,11.25 D5.2 14.65,8.55 C2-EP-DR.2 v14.2,8.05 | L5.1 v5.4,2.3
  Bottom 0.15: v5.4,2.3 11.15,8.05 v14.2,8.05
N$7
  Top 0.15: C2-EP-DR.1 16.6,8.5 D4.2 D2.1
N$8
  Top 0.15: R4.2 36,29.82 IC9.D1
N$9
  Top 0.15: R2.2 36.4,29.88 IC9.E1
N$10
  Top 0.15: R3.2 12.82,28.85 IC3.1
N$11
  Top 0.15: R1_USB.2 24.25,27.98 J4.A5
N$13
  Top 0.15: J1.4 EPD_C2.2
N$14
  Top 0.15: J1.5 11.8,21.25 EPD_C1.2
N$15
  Top 0.15: R1_EP_DR.1 14.18,22.7 R_TYPE_SEL.2 14.6,22.68 14.84,22.44 SJ1.2
N$17
  Top 0.15: J4.B5 21.27,28.95 R2_USB.1
N$19
  Top 0.15: C32.2 IC2.A2
N$23
  Top 0.15: J1.18 11,14.75 EPD_C6.2
N$24
  Top 0.15: J1.19 11.4,14.25 EPD_C7.2
N$25
  Top 0.15: J1.20 11.8,13.75 EPD_C8.2
N$27
  Top 0.15: J1.22 11.3,12.75 EPD_C10.2
N$29
  Top 0.15: EPD_C12.2 10.62,10.22 J1.24
N$45
  Top 0.15: C9.1 34.09,15.75 U1.P$N24
N$49
  Top 0.15: U1.P$B24 33.85,18.85 C1.1 34.34,19.05 34.58,19.27 35.42,19.27 35.52,19.38 X1.1
N$50
  Top 0.15: U1.P$A23 C2.1 33.45,19.84 33.73,20.12 33.73,20.88 34.38,21.52 X1.3
N$54
  Top 0.15: C13.1 31.55,19.45 U1.P$A18
N$69
  Top 0.15: L2.2 28,22.5 L3.1
N$70
  Top 0.15: U1.P$B3 L2.1
OUT+
  Top 0.15: TP_OP.TP 3.5,32.5 4.3,33.3 IC2.A3
OUT-
  Top 0.15: TP_ON.TP 9.7,33.3 IC2.C3
P0.00
  Top 0.15: X2.2 25.95,19 26.7,18.25 C17.2 26.91,17.9 27.65,17.9 U1.P$D2
P0.01
  Top 0.15: X2.1 25.95,16.5 26.7,17.25 C18.2 26.91,17.6 27.65,17.6 U1.P$F2
P0.13  (via drill 0.2)
  Top 0.15: C30.2 10.31,4.26 SW_UP.2 | R5.1 10.28,4.91 C30.2 | v29.15,11.85 29.15,12.65 U1.P$AD8 | v23.6,6.35 11.57,6.35 10.31,5.09 C30.2
  Bottom 0.15: v29.15,11.85 23.65,6.35 v23.6,6.35
P0.14  (via drill 0.2)
  Top 0.15: C31.2 21.32,4.11 SW_ENT.2 | R8.1 21.29,4.78 C31.2 | v23.2,5.25 21.57,5.25 21.32,5 C31.2
  Bottom 0.15: U1.P$AC9 29.6,13.15 29.6,11.6 23.25,5.25 v23.2,5.25
  other vias: 29.5,13.25
P1.01  (via drill 0.2)
  Top 0.15: Q1.1 17.38,15.62 R_PWR_EPD.1 19.6,13.72 19.6,12.22 23,8.82 31.84,8.82 32.3,9.28 v32.3,11.2
  Bottom 0.15: U1.P$Y23 33.25,13.6 32.55,12.9 32.55,11.45 v32.3,11.2
  other vias: 33.25,14
P1.02  (via drill 0.2)
  Top 0.15: SW_DN.2 32.33,4.25 32.33,4.94 C29.2 | R7.1 31.77,4.95 C29.2 | C29.2 32.31,5.41 35.8,8.9 v35.8,10.4 | U1.P$W24 v35.8,14.25
  Bottom 0.15: v35.8,10.4 v35.8,14.25
PMIC_INT  (via drill 0.2)
  Top 0.15: v23.25,14 23.3,14.05 23.3,20.7 28.8,26.2 28.8,29.48 29.34,30.03 30.02,30.03 IC1.A1
  Bottom 0.15: U1.P$T2 26.75,14 v23.25,14
  other vias: 27.75,15
PREVGH
  Top 0.3: J1.21 11.7,13.25 EPD_C9.2 12.7,13.45 14.45,13.45 D5.1
PREVGL  (via drill 0.3)
  Top 0.3: J1.23 11.2,12.25 11.5,11.95 11.5,11.35 11.8,11.05 EPD_C11.2 v12.1,10.2 | v18.5,11.9 D2.2
  Route15 0.3: v18.5,11.9 16.8,10.2 v12.1,10.2
RESE
  Top 0.15: J1.3 11.82,22.25 R1_EP_DR.2 12.28,22.74 12.62,23.08 14.92,23.08 Q3.2
RESET  (via drill 0.2, 0.3)
  Top 0.15: TP_RESET.TP 38.3,6.6 39.71,8.01 J2.6 39.39,8.31 v38.8,8.9
  Bottom 0.15: U1.P$AC13 30.5,12.15 33.75,8.9 v38.8,8.9
  other vias: 30.5,13.25
RF
  Top 0.3: ANT1.1 C4.1 C22.1 L1.2
SCK  (via drill 0.2)
  Top 0.15: v11.9,18.15 11,17.25 J1.13 | v30.7,22.4 30.7,19.7 U1.P$A12
  Bottom 0.15: v11.9,18.15 17.23,23.48 26.22,23.48 27.3,22.4 v30.7,22.4
SCL  (via drill 0.2)
  Top 0.15: v37.5,26.85 U3.7 | TP_SCL.TP v15.7,31.4 13.35,29.05 IC3.12 | v25.55,22.35 29.1,25.9 29.1,29.25 v29.5,29.65 29.7,29.65 30.1,29.25 IC1.B1 | R17.1 35.88,29.2 R4.1 35.88,29.18 v35.3,28.6 | IC2.C1 v7.6,31.4
  Bottom 0.15: v7.6,31.4 v15.7,31.4 27.75,31.4 v29.5,29.65 30.55,28.6 v35.3,28.6 35.75,28.6 v37.5,26.85 | U1.P$M2 27.71,16 27.3,16.41 27.3,20.6 v25.55,22.35
  other vias: 27.75,16
SDA  (via drill 0.2)
  Top 0.15: R18.1 37.15,29.18 R2.1 35.88,28.51 35.88,28.15 36.02,28.02 | U3.8 36.02,28.02 | 36.02,28.02 35.32,28.02 v35.3,28 | IC3.2 12.35,27.85 v12.15,28.05 12.15,32.65 TP_SDA.TP | v25.75,21.35 25.75,21.85 29.4,25.5 29.4,28.15 v29.5,28.25 29.5,28.55 29.8,28.85 IC1.C1 | v26.7,16.25 U1.P$L1
  Bottom 0.15: v35.3,28 35.05,28.25 30.2,28.25 | 30.2,28.25 27.45,31 7.45,31 | v12.15,28.05 10.4,28.05 7.45,31 | 7.45,31 6.2,32.25 IC2.B2 | v26.7,16.25 26.7,19.6 25.75,20.55 v25.75,21.35 | v29.5,28.25 30.2,28.25
  other vias: 6.2,32.8
SWDCLK  (via drill 0.2)
  Top 0.15: TP_SWDCLK.TP 40.9,4.6 41.9,5.6 41.9,7.4 v41.58,7.71 J2.4 | v36.65,13.75 U1.P$AA24
  Bottom 0.15: v36.65,13.75 37.05,13.35 40.85,13.35 41.9,12.3 41.9,10.33 41.58,10.02 v41.58,7.71
SWDIO
  Top 0.15: J2.2 42.78,8.31 43.1,8 43.9,8 | 43.9,8 45.3,9.4 45.3,13 45.05,13.25 U1.P$AC24 | 43.9,8 44.8,8 45.3,7.5 45.3,5.4 43.65,3.75 TP_SWDIO.TP
SWO
  Top 0.15: TP_SWO.TP 28.6,3.95 32.75,8.1 U1.P$AD22
VBAT
  Top 0.268: IC1.C2 31.48,28.85 C37.2 32,28.69 | 34.7,26.84 C27.2 33.65,28.23
  Top 0.3: 34.7,26.84 U3.2 U3.3 | 33.65,28.23 33.2,28.69 33,28.69 | 32,28.69 33,28.69 | TP_VBAT.TP 32.1,27.79 33,28.69
VBUS  (via drill 0.35)
  Top 0.268: IC1.A2 C38.2 30.5,30.41 | 25.9,27.68 C42.1 26.98,27.59
  Top 0.3: U1.P$AD2 27.65,12.65 C21.1 v26.5,11.85 | 25.9,27.68 25.4,28.18 J4.A4_B9 25.4,29.44 24.69,30.15 21.31,30.15 20.6,29.44 J4.A9_B4 | v21.7,22.4 23,23.7 D3.5 23,24.44 23.56,25 26.34,25 28.4,27.06 28.4,28.6 | 28.4,28.6 27.4,27.6 C43.1 26.98,27.59 | 30.5,30.41 29.23,30.41 28.4,29.58 28.4,28.6
  Route15 0.3: v26.5,11.85 23.4,11.85 21.3,13.95 21.3,22 v21.7,22.4
VREG
  Top 0.268: IC9.A1 IC9.A2 IC9.A3 C23.2 | IC1.B2 31.4,29.25 C39.1 | 33.84,31.96 C23.2 | C23.2 33.84,30.62
  Top 0.3: TP_VREG.TP 32.5,33.3 33.84,31.96 | 33.84,30.62 C24.2 32.85,29.6 C39.1
(copper drawn outside any net)
  shapes: Bottom area x1, Route15 area x1, Route2 area x1, Top area x1

### Text on the board
tPlace: ██████████ / █████████████████ / █ ████████████████████ / ███ ███████ ████████████ / ████ ███████ █████████████ / █████ ███████ ██████████████ / ██████ ███████ ███████████████ / ███████ ███████ ██████ ██████ / ███████ ███████ ██████ ███████ / ███████ ███████ ██████ ███████ / ███████ ███████ ██████ ███████ / ███████ ███████ ██████ ███████ / ████████████████ ██████ ██████ / ████████████████ ██████ ██████ / ███████████████ ██████ █████ / ██████████████ ██████ ███▓ / ████████████ ██████ ██ / ███████████████████ / ████████████████ / ░▓▓░